# Altium project HYDRA_V3_CAMERA.PrjPcb
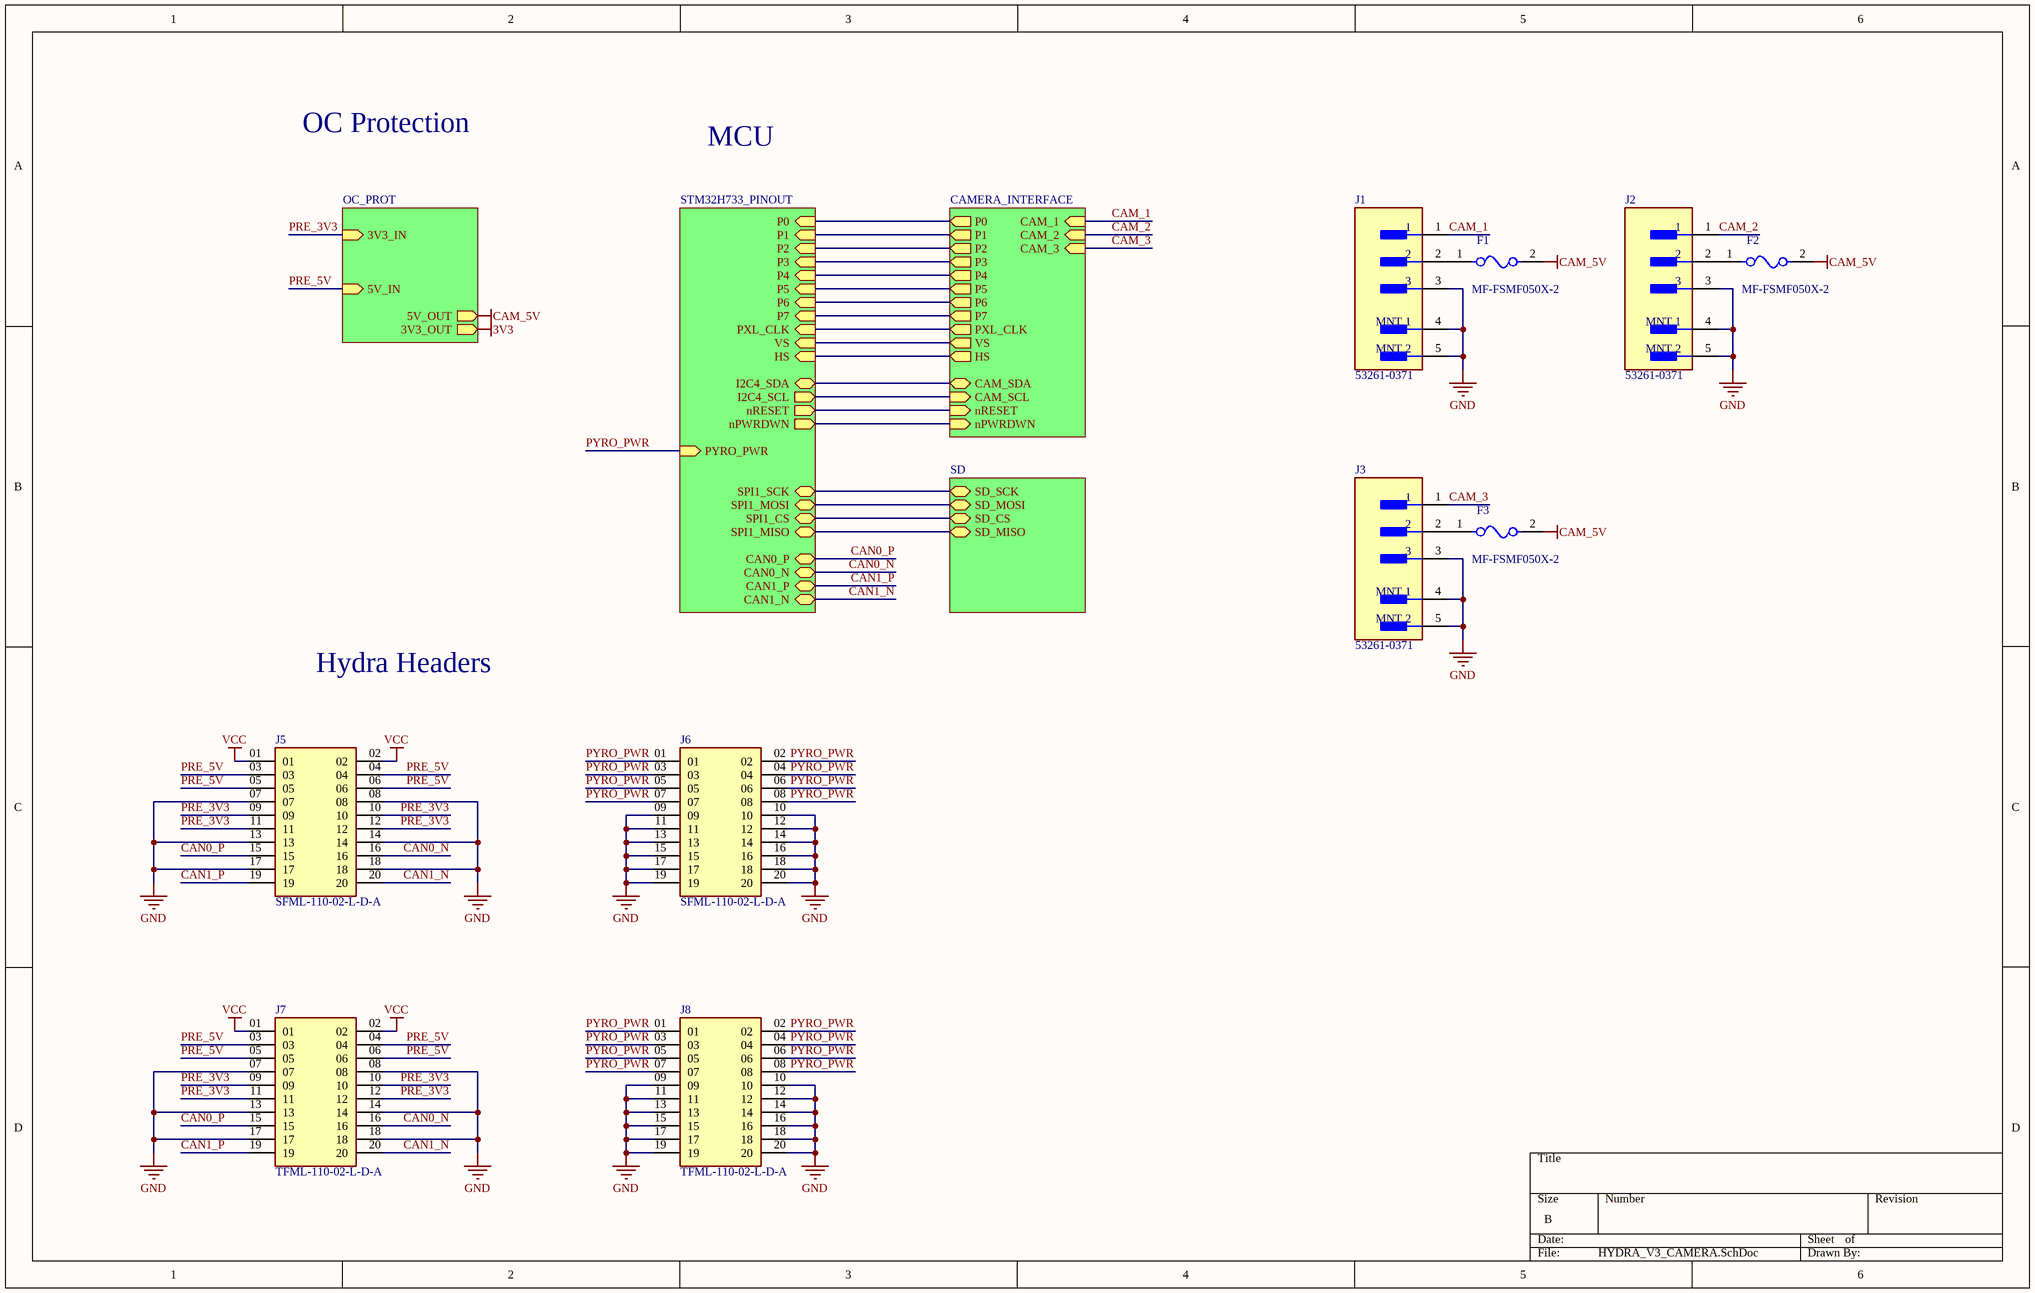
[diagram p0: HYDRA_V3_CAMERA.SchDoc]
5 sheets, 137 parts. Net scope: hierarchical (ports join the sheet entries above them; power ports are global).
Board file: HYDRA_V3_CAMERA.PcbDoc
Sheets:
  HYDRA_V3_CAMERA.SchDoc
    OC_PROT = OC_PROT.SchDoc
    MCU_PINOUT = STM32H733_PINOUT.SchDoc
    SD = SD.SchDoc
    CAMERA_INTERFACE = CAMERA_INTERFACE.SchDoc

## Sheet HYDRA_V3_CAMERA.SchDoc
size B; SheetNumber: 1; SheetTotal: 5

### Parts
F1  MF-FSMF050X-2  [FP-MF-FSMF-MFG]
F2  MF-FSMF050X-2  [FP-MF-FSMF-MFG]
F3  MF-FSMF050X-2  [FP-MF-FSMF-MFG]
J1  53261-0371  [FP-53261-0371-MFG]
J2  53261-0371  [FP-53261-0371-MFG]
J3  53261-0371  [FP-53261-0371-MFG]
J5  SFML-110-02-L-D-A  [SFML-110-02-L-D-A-Footprint-1]
J6  SFML-110-02-L-D-A  [SFML-110-02-L-D-A-Footprint-1]
J7  TFML-110-02-L-D-A  [TFML-110-02-L-D-A-Footprint-1]
J8  TFML-110-02-L-D-A  [TFML-110-02-L-D-A-Footprint-1]

### Sub-sheets
CAMERA_INTERFACE = CAMERA_INTERFACE: P0 (out), P1 (out), P2 (out), P3 (out), P4 (out), P5 (out), P6 (out), P7 (out), PXL_CLK (out), VS (out), HS (out), CAM_1 (in), CAM_2 (in), CAM_3 (in), CAM_SDA (bidir), CAM_SCL (in), nRESET (in), nPWRDWN (in)
MCU_PINOUT = STM32H733_PINOUT: CAN0_P (bidir), CAN0_N (bidir), PYRO_PWR (in), CAN1_P (bidir), CAN1_N (bidir), SPI1_SCK (bidir), SPI1_MISO (bidir), SPI1_MOSI (bidir), SPI1_CS (bidir), P0 (in), P1 (in), P2 (in), P3 (in), P4 (in), P5 (in), P6 (in), P7 (in), PXL_CLK (in), VS (in), HS (in), I2C4_SDA (bidir), I2C4_SCL (out), nRESET (out), nPWRDWN (out)
OC_PROT = OC_PROT: 5V_OUT (out), 5V_IN (in), 3V3_IN (in), 3V3_OUT (out)
SD = SD: SD_SCK (bidir), SD_MOSI (bidir), SD_CS (bidir), SD_MISO (bidir)

### Nets
CAM_5V: F1.2 F2.2 F3.2 ; sheet OC_PROT/5V_OUT
GND: J1.3 J1.4(MNT_1) J1.5(MNT_2) J2.3 J2.4(MNT_1) J2.5(MNT_2) J3.3 J3.4(MNT_1) J3.5(MNT_2) J5.07 J5.08 J5.13 J5.14 J5.17 J5.18 J6.09 J6.10 J6.11 J6.12 J6.13 J6.14 J6.15 J6.16 J6.17 J6.18 J6.19 J6.20 J7.07 J7.08 J7.13 J7.14 J7.17 J7.18 J8.09 J8.10 J8.11 J8.12 J8.13 J8.14 J8.15 J8.16 J8.17 J8.18 J8.19 J8.20
VCC: J5.01 J5.02 J7.01 J7.02
CAM_1: J1.1 ; sheet CAMERA_INTERFACE/CAM_1
CAM_2: J2.1 ; sheet CAMERA_INTERFACE/CAM_2
CAM_3: J3.1 ; sheet CAMERA_INTERFACE/CAM_3
CAM_SCL: sheet MCU_PINOUT/I2C4_SCL, sheet CAMERA_INTERFACE/CAM_SCL
CAM_SDA: sheet MCU_PINOUT/I2C4_SDA, sheet CAMERA_INTERFACE/CAM_SDA
CAN0_N: J5.16 J7.16 ; sheet MCU_PINOUT/CAN0_N
CAN0_P: J5.15 J7.15 ; sheet MCU_PINOUT/CAN0_P
CAN1_N: J5.20 J7.20 ; sheet MCU_PINOUT/CAN1_N
CAN1_P: J5.19 J7.19 ; sheet MCU_PINOUT/CAN1_P
HS: sheet MCU_PINOUT/HS, sheet CAMERA_INTERFACE/HS
LLC: sheet MCU_PINOUT/PXL_CLK, sheet CAMERA_INTERFACE/PXL_CLK
nPWRDWN: sheet MCU_PINOUT/nPWRDWN, sheet CAMERA_INTERFACE/nPWRDWN
nRESET: sheet MCU_PINOUT/nRESET, sheet CAMERA_INTERFACE/nRESET
P0: sheet MCU_PINOUT/P0, sheet CAMERA_INTERFACE/P0
P1: sheet MCU_PINOUT/P1, sheet CAMERA_INTERFACE/P1
P2: sheet MCU_PINOUT/P2, sheet CAMERA_INTERFACE/P2
P3: sheet MCU_PINOUT/P3, sheet CAMERA_INTERFACE/P3
P4: sheet MCU_PINOUT/P4, sheet CAMERA_INTERFACE/P4
P5: sheet MCU_PINOUT/P5, sheet CAMERA_INTERFACE/P5
P6: sheet MCU_PINOUT/P6, sheet CAMERA_INTERFACE/P6
P7: sheet MCU_PINOUT/P7, sheet CAMERA_INTERFACE/P7
PRE_3V3: J5.09 J5.10 J5.11 J5.12 J7.09 J7.10 J7.11 J7.12 ; sheet OC_PROT/3V3_IN  [project net 3V3_PRE_SHUNT]
PRE_5V: J5.03 J5.04 J5.05 J5.06 J7.03 J7.04 J7.05 J7.06 ; sheet OC_PROT/5V_IN  [project net 5V_PRE_SHUNT]
PYRO_PWR: J6.01 J6.02 J6.03 J6.04 J6.05 J6.06 J6.07 J6.08 J8.01 J8.02 J8.03 J8.04 J8.05 J8.06 J8.07 J8.08 ; sheet MCU_PINOUT/PYRO_PWR
SD_CLK: sheet MCU_PINOUT/SPI1_SCK, sheet SD/SD_SCK
SD_CMD: sheet MCU_PINOUT/SPI1_MOSI, sheet SD/SD_MOSI
SD_CS: sheet MCU_PINOUT/SPI1_CS, sheet SD/SD_CS
SD_DAT0: sheet MCU_PINOUT/SPI1_MISO, sheet SD/SD_MISO
VS: sheet MCU_PINOUT/VS, sheet CAMERA_INTERFACE/VS
NetF1_1: F1.1 J1.2
NetF2_1: F2.1 J2.2
NetF3_1: F3.1 J3.2

### Notes on the sheet
- OC Protection
- MCU
- Hydra Headers

### Library data of the parts
F1-F3 = CMP-07400-000010-1: PTC RESET FUSE 6V 500MA 0603; Manufacturer: Bourns Inc.; Trip Current: 1A; Current Rating: 40A; Hold Current: 0.5A; Resistance: 0.1-0.8Ω; Value: 0.1-0.8Ω; Trip Time: 0.1s; Mouser Description: Resettable Fuses - PPTC 6volts 40amps; Category: Fuse; Digikey Description: PTC RESET FUSE 6V 500MA 0603; Temperature: -40°C to +85°C; Device Class L3: unset; Automotive: No; RoHS: TRUE; Ambient Temperature Range High: +85°C; Device Class L2: PTC Resettable Fuses; Temperature Range High: +85°C; Voltage Rating: 6V; Package: MF-FSMF; Manufacturer Part Number: MF-FSMF050X-2; Ambient Temperature Range Low: -40°C; Lead Free: Yes; ComponentLink2Description: Datasheet; Octopart: https://octopart.com/mf-fsmf050x-2-bourns-10470804; ComponentLink2URL: https://www.bourns.com/docs/Product-Datasheets/mffsmf.pdf; Temperature Range Low: -40°C; Height: 1mm; Device Class L1: Circuit Protection
J1-J3 = CMP-04776-000071-1: CONN HEADER SMD R/A 3POS 1.25MM; Manufacturer: Molex; Number Of Contacts: 3; Conn Orientation: Right Angle; Current Rating: 1A; Voltage Rating: 125V; Conn Gender: Male; Category: Conn; Automotive: No; Footprint Url: https://www.molex.com/pdm_docs/sd/532610371_sd.pdf; Height: 3.6mm; Number Of Rows: 1; Temperature Range Low: -40°C; Package: 0; Octopart: https://octopart.com/53261-0371-molex-655314; ComponentLink2Description: Datasheet; Lead Free: Yes; Ambient Temperature Range Low: -40°C; Device Class L3: unset; Mouser Description: 1.25mm (.049") Pitch PicoBlade Header, Surface Mount, Right Angle, Lead-free, 3 Circuits; Digikey Description: CONN HEADER SMD R/A 3POS 1.25MM; Device Class L2: Headers and Wire Housings; Contact Material: Tin,Nickel; Manufacturer Part Number: 53261-0371; Ambient Temperature Range High: +105°C; ComponentLink2URL: https://www.molex.com/webdocs/datasheets/pdf/en-us/0532610371_PCB_HEADERS.pdf; Pitch: 1.25mm; Temperature: -40°C to +105°C; RoHS: TRUE; Device Class L1: Connectors; Temperature Range High: +105°C
J5 J6 = CMP-002-00076-2: Headers & Wire Housings .050 Tiger Eye High-Reliability Locking Socket Strip
J7 J8 = CMP-002-00077-1: Conn Shrouded Header (4 Sides) HDR 20 POS 1.27mm Solder ST Top Entry SMD TIGER EYE™ Tube

## Sheet OC_PROT.SchDoc
size C; SheetNumber: 2; SheetTotal: 5
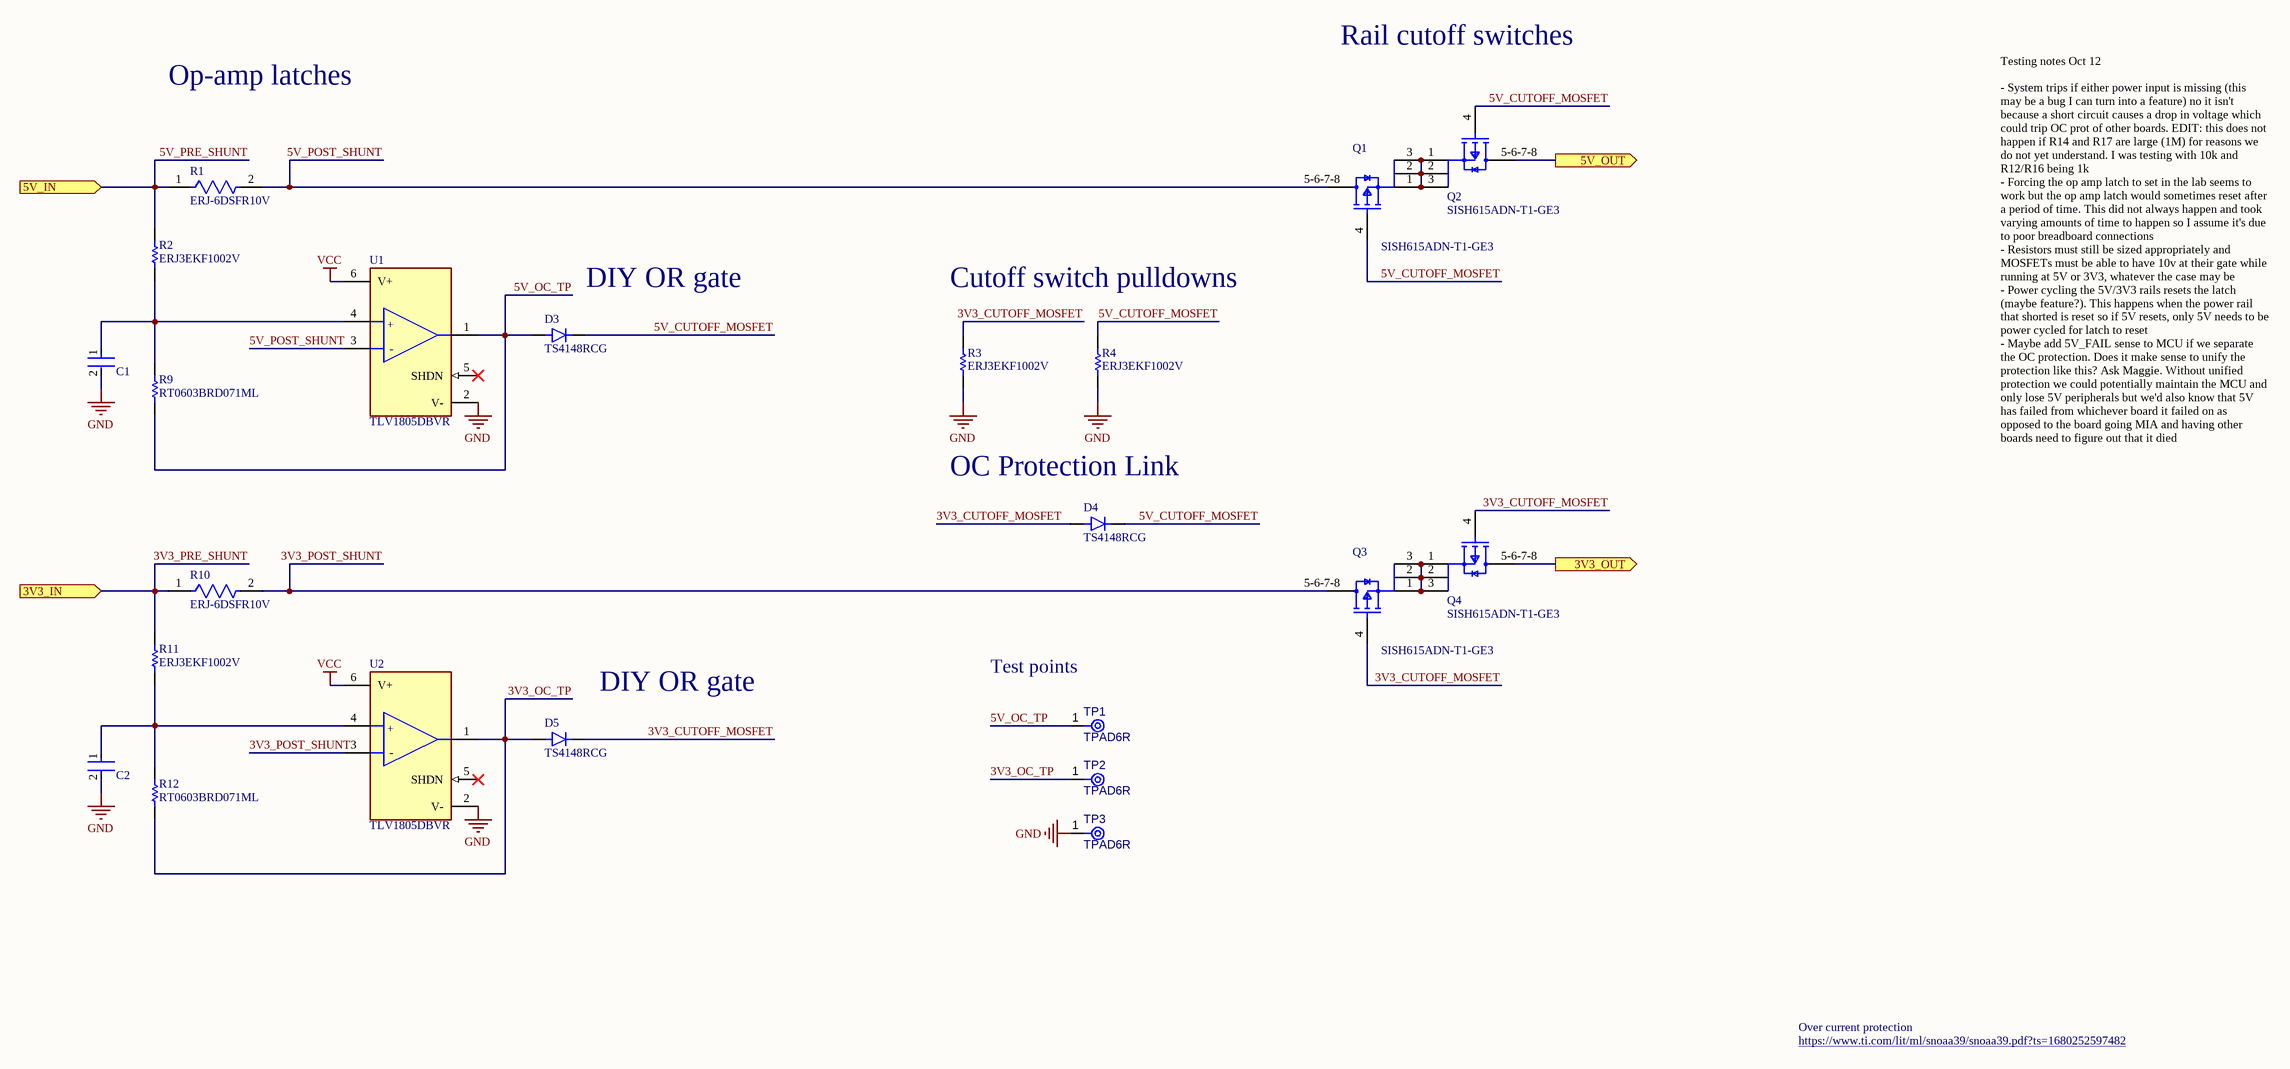
[diagram p1: OC_PROT.SchDoc]

### Parts
C1  C0402C104K8PACTU  [FP-C0402-BB-MFG]  (value not drawn)
C2  C0402C104K8PACTU  [FP-C0402-BB-MFG]  (value not drawn)
D3  TS4148RCG  [TS4148RCG-Footprint-1]
D4  TS4148RCG  [TS4148RCG-Footprint-1]
D5  TS4148RCG  [TS4148RCG-Footprint-1]
Q1  SISH615ADN-T1-GE3  [SISH615ADN-T1-GE3-Footprint-1]
Q2  SISH615ADN-T1-GE3  [SISH615ADN-T1-GE3-Footprint-1]
Q3  SISH615ADN-T1-GE3  [SISH615ADN-T1-GE3-Footprint-1]
Q4  SISH615ADN-T1-GE3  [SISH615ADN-T1-GE3-Footprint-1]
R1  ERJ-6DSFR10V  [FP-ERJ6D-MFG]
R2  ERJ3EKF1002V  [RESC1609X55X30LL15T15]
R3  ERJ3EKF1002V  [RESC1609X55X30LL15T15]
R4  ERJ3EKF1002V  [RESC1609X55X30LL15T15]
R9  RT0603BRD071ML  [RESC1608X55X30NL20T20]
R10  ERJ-6DSFR10V  [FP-ERJ6D-MFG]
R11  ERJ3EKF1002V  [RESC1609X55X30LL15T15]
R12  RT0603BRD071ML  [RESC1608X55X30NL20T20]
TP1  TPAD6R  [TP06R]  (no BOM)
TP2  TPAD6R  [TP06R]  (no BOM)
TP3  TPAD6R  [TP06R]  (no BOM)
U1  TLV1805DBVR  [FP-DBV0006A-IPC_C]
U2  TLV1805DBVR  [FP-DBV0006A-IPC_C]

### Ports
3V3_IN (in, see HYDRA_V3_CAMERA[1A]), 3V3_OUT (out, see HYDRA_V3_CAMERA[2B]), 5V_IN (in, see HYDRA_V3_CAMERA[1A]), 5V_OUT (out, see HYDRA_V3_CAMERA[2A])

### Nets
CAM_5V: Q2.5-6-7-8(D) ; port 5V_OUT
DVDDIO: Q4.5-6-7-8(D) ; port 3V3_OUT
GND: C1.2 C2.2 R3.1 R4.1 TP3.1(TP) U1.2(V-) U2.2(V-)
VCC: U1.6(V+) U2.6(V+)
3V3_CUTOFF_MOSFET: D4.A D5.C(K) Q3.4(G) Q4.4(G) R3.2
3V3_OC_TP: D5.A R12.1 TP2.1(TP) U2.1(OUT)
3V3_POST_SHUNT: Q3.5-6-7-8(D) R10.2 U2.3(-IN)
3V3_PRE_SHUNT: R10.1 R11.2 ; port 3V3_IN
5V_CUTOFF_MOSFET: D3.C(K) D4.C(K) Q1.4(G) Q2.4(G) R4.2
5V_OC_TP: D3.A R9.1 TP1.1(TP) U1.1(OUT)
5V_POST_SHUNT: Q1.5-6-7-8(D) R1.2 U1.3(-IN)
5V_PRE_SHUNT: R1.1 R2.2 ; port 5V_IN
NetC1_1: C1.1 R2.1 R9.2 U1.4(+IN)
NetC2_1: C2.1 R11.1 R12.2 U2.4(+IN)
NetQ1_1: Q1.1(S) Q1.2(S) Q1.3(S) Q2.1(S) Q2.2(S) Q2.3(S)
NetQ3_1: Q3.1(S) Q3.2(S) Q3.3(S) Q4.1(S) Q4.2(S) Q4.3(S)

Not connected (* = marked no-connect by the designer): U1 5(SHDN)*; U2 5(SHDN)*

### Notes on the sheet
- Rail cutoff switches
- Op-amp latches
- (near D3) DIY OR gate
- Cutoff switch pulldowns
- (near D4) OC Protection Link
- Testing notes Oct 12
  - System trips if either power input is missing (this may be a bug I can turn into a feature) no it isn't because a short circuit causes a drop in voltage which could trip OC prot of other boards. EDIT: this does not happen if R14 and R17 are large (1M) for reasons we do not yet understand. I was testing with 10k and R12/R16 being 1k
  - Forcing the op amp latch to set in the lab seems to work but the op amp latch would sometimes reset after a period of time. This did not always happen and took varying amounts of time to happen so I assume it's due to poor breadboard connections
  - Resistors must still be sized appropriately and MOSFETs must be able to have 10v at their gate while running at 5V or 3V3, whatever the case may be
  - Power cycling the 5V/3V3 rails resets the latch (maybe feature?). This happens when the power rail that shorted is reset so if 5V resets, only 5V needs to be power cycled for latch to reset
  - Maybe add 5V_FAIL sense to MCU if we separate the OC protection. Does it make sense to unify the protection like this? Ask Maggie. Without unified protection we could potentially maintain the MCU and only lose 5V peripherals but we'd also know that 5V has failed from whichever board it failed on as opposed to the board going MIA and having other boards need to figure out that it died
- (near TP1) Test points
- (near D5) DIY OR gate
- https://www.ti.com/lit/ml/snoaa39/snoaa39.pdf?ts=1680252597482
- Over current protection
- (in symbol CMP-04896-000098-1) +; -

### Library data of the parts
C1 C2 = CMP-2008-02046-2: CAP CER 0.1UF 10V X5R 0402; Manufacturer: Kemet; Material: Ceramic; Capacitance: 0.10 μF; Temperature Coefficient: 15%; Tolerance: 0.1; Value: 0.10 μF; Package: C0402-BB; Temperature: -55°C to +125°C; ComponentLink2Description: Datasheet; Temperature Characteristic: X5R; Device Class L1: Passive Components; Height: 0.55mm; Lead Free: Yes; ComponentLink2URL: https://content.kemet.com/datasheets/KEM_C1002_X7R_SMD.pdf; Device Class L2: Capacitors; Temperature Range Low: -55°C; Temperature Range High: +125°C; RoHS: TRUE; Octopart: https://octopart.com/c0402c104k8pactu-kemet-140039; Automotive: No; Mouser Description: Capacitor 100 nF 10 VDC 0402; Category: Cap; Voltage Rating: 10 V; Digikey Description: CAP CER 0.1UF 10V X5R 0402; Ipc Land Pattern Name: CAPC10050X50; Device Class L3: Ceramic Capacitors; Manufacturer Part Number: C0402C104K8PACTU
D3-D5 = CMP-004-00036-1: SMD Si-Diode 75V 100mA 0603
Q1-Q4 = CMP-013-00036-1: Trans MOSFET P-CH 20V 22.1A 8-Pin PowerPAK 1212 EP T/R
R1 R10 = CMP-05422-000098-1: RES 0.1 OHM 1% 1/2W 0805; Temperature Coefficient: 150ppm/°C; Resistance: 100mR; Max Power Dissipation: 500mW; Tolerance: 1%; Length: 0.079inch; Features: Automotive AEC-Q200; Width: 0.049inch; Resistor Type: Thick Film; Case Code (Metric): 2012; Number of Terminations: 2; Max Operating Temperature: 155°C; Case/Package: 0805; Height: 0.028inch; Packaging: Cut Tape; Case Code (Imperial): 0805; Min Operating Temperature: -55°C
R2-R4 R11 = CMP-1012-00623-3: Chip Resistor, 10 KOhm, +/- 1%, 0.1 W, -55 to 155 degC, 0603 (1608 Metric), RoHS, Tape and Reel; Manufacturer: Panasonic; Voltage Rating: 75V; Case\/Package: 0603; Power Rating: 100mW; Resistance: 10KOhm; Temperature Coefficient: 100ppm\/degreesC; Number of Pins: 2; Package Reference: 603; Depth: 0.8mm; Mount: SurfaceMount; Package Description: 2-Pin Surface Mount Device, Body 1.6 x 0.85 mm; Datasheet Version: 02/2017; Length: 1.6mm; Lead Free: LeadFree; Height: 0.45mm; Number of Terminations: 2; Max Power Dissipation: 100mW; Min Operating Temperature: -55degC; Datasheet URL: https://industrial.panasonic.com/cdbs/www-data/pdf/RDA0000/AOA0000C304.pdf; Termination: SMD/SMT; Case Code (Metric): 1608; Case Code (Imperial): 0603; Tolerance: 1%; Max Operating Temperature: 155degC; RoHSCompliant: true; Voltage Rating (DC): 75V; Radiation Hardening: No; Packaging: TapeandReel; Composition: ThickFilm; Mounting Technology: SurfaceMount; Manufacturer URL: http://www.panasonic.com/; Width: 0.031inch; REACH SVHC: NoSVHC; Contact Plating: Tin; Military Standard: Not; Package Quantity: 1
R9 R12 = CMP-2000-00925-1: NOT PANASONIC, THIS IS A 1M RESISTORhttps://www.yageo.com/upload/media/product/productsearch/datasheet/rchip/PYu-RT_1-to-0.01_RoHS_L_13.pdf; Part Number: ERA-3AEB163V; Manufacturer: Panasonic
TP1-TP3 = CMP-00028-00002-2: 0.6mm round; Pins: 1
U1 U2 = CMP-04896-000098-1: 40V, RAIL-TO-RAIL INPUT, PUSH-PU

## Sheet STM32H733_PINOUT.SchDoc
size C; SheetNumber: 4; SheetTotal: 5
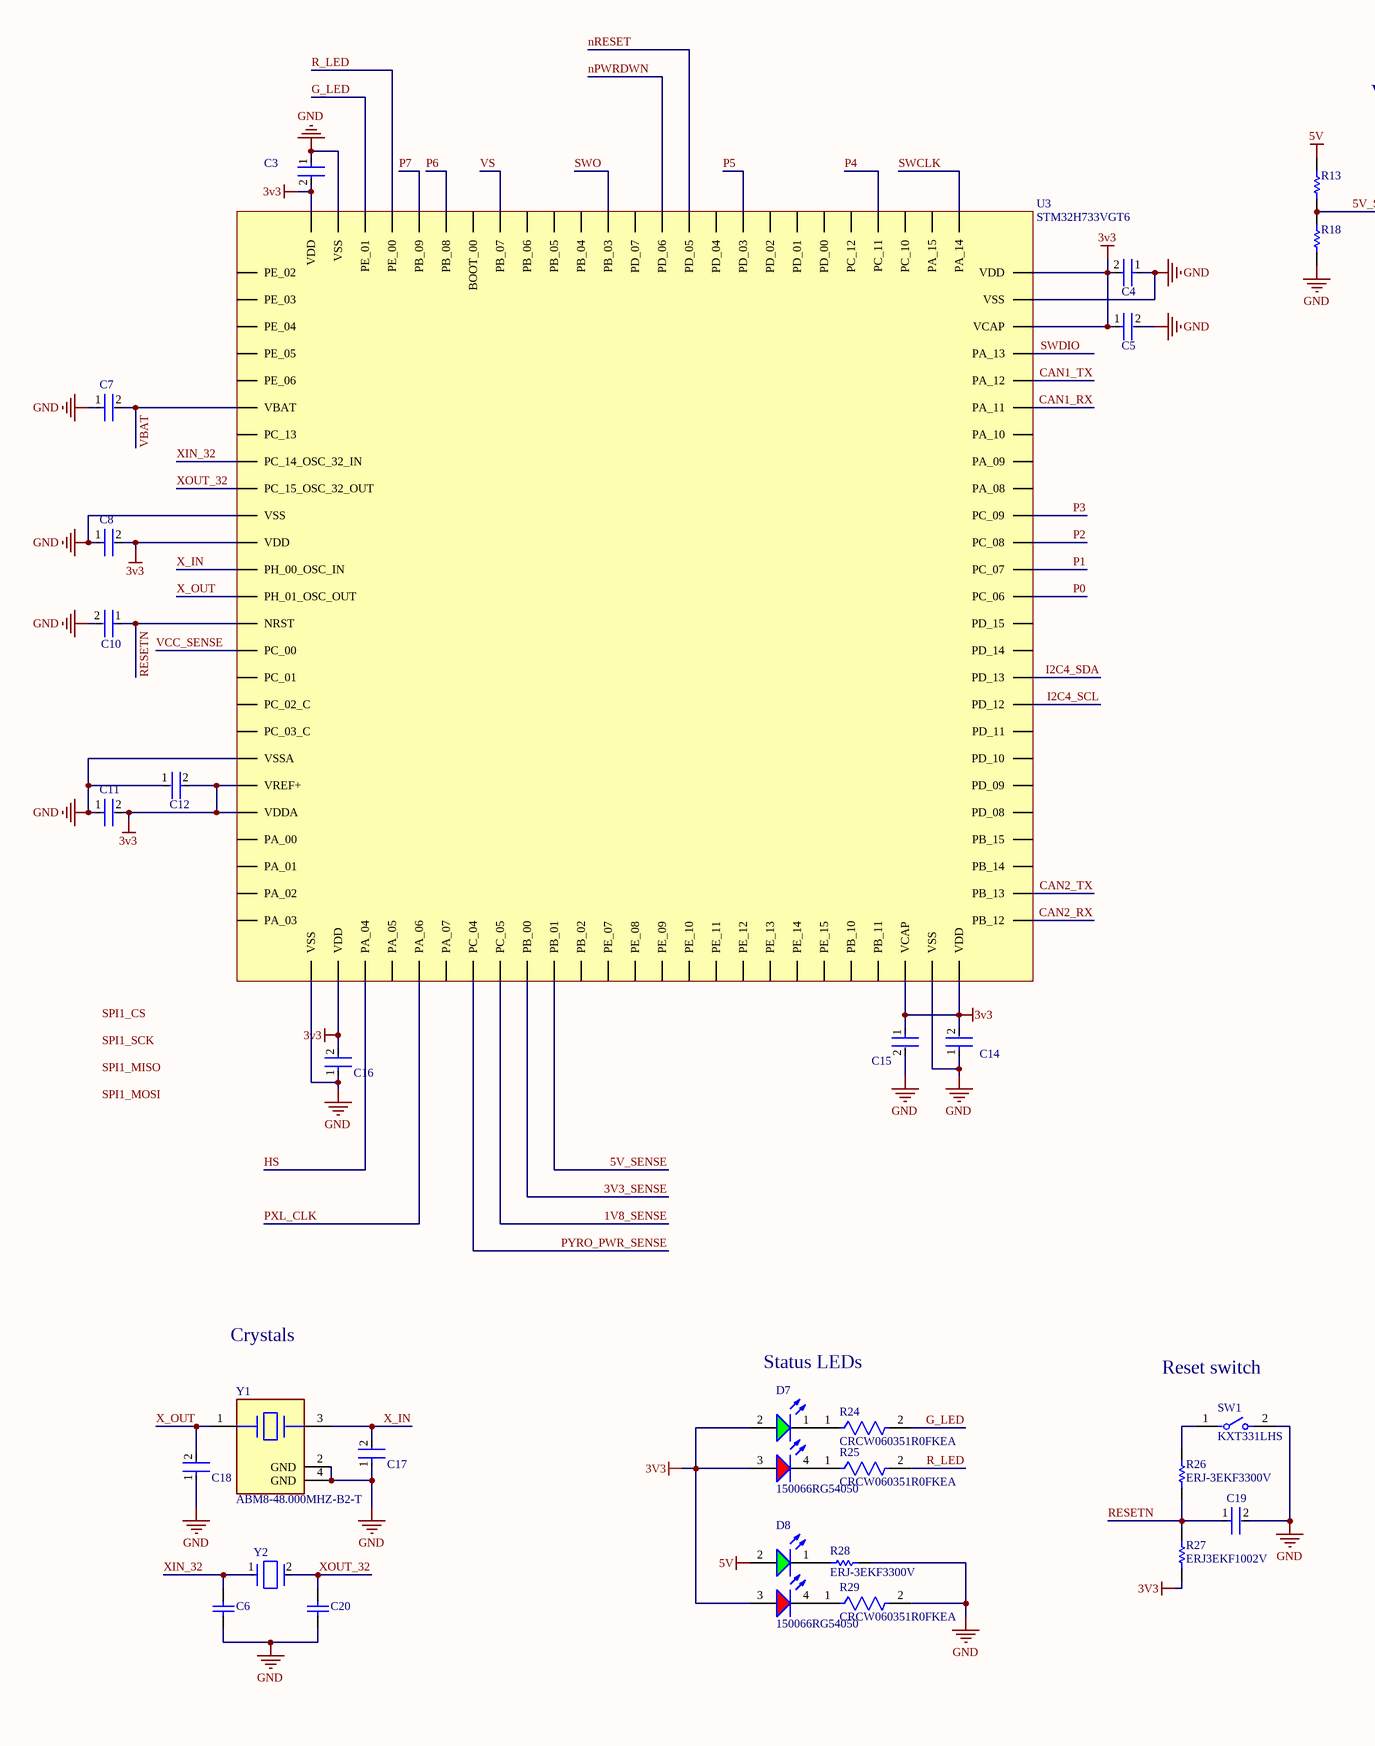
[diagram p2: STM32H733_PINOUT.SchDoc, left]
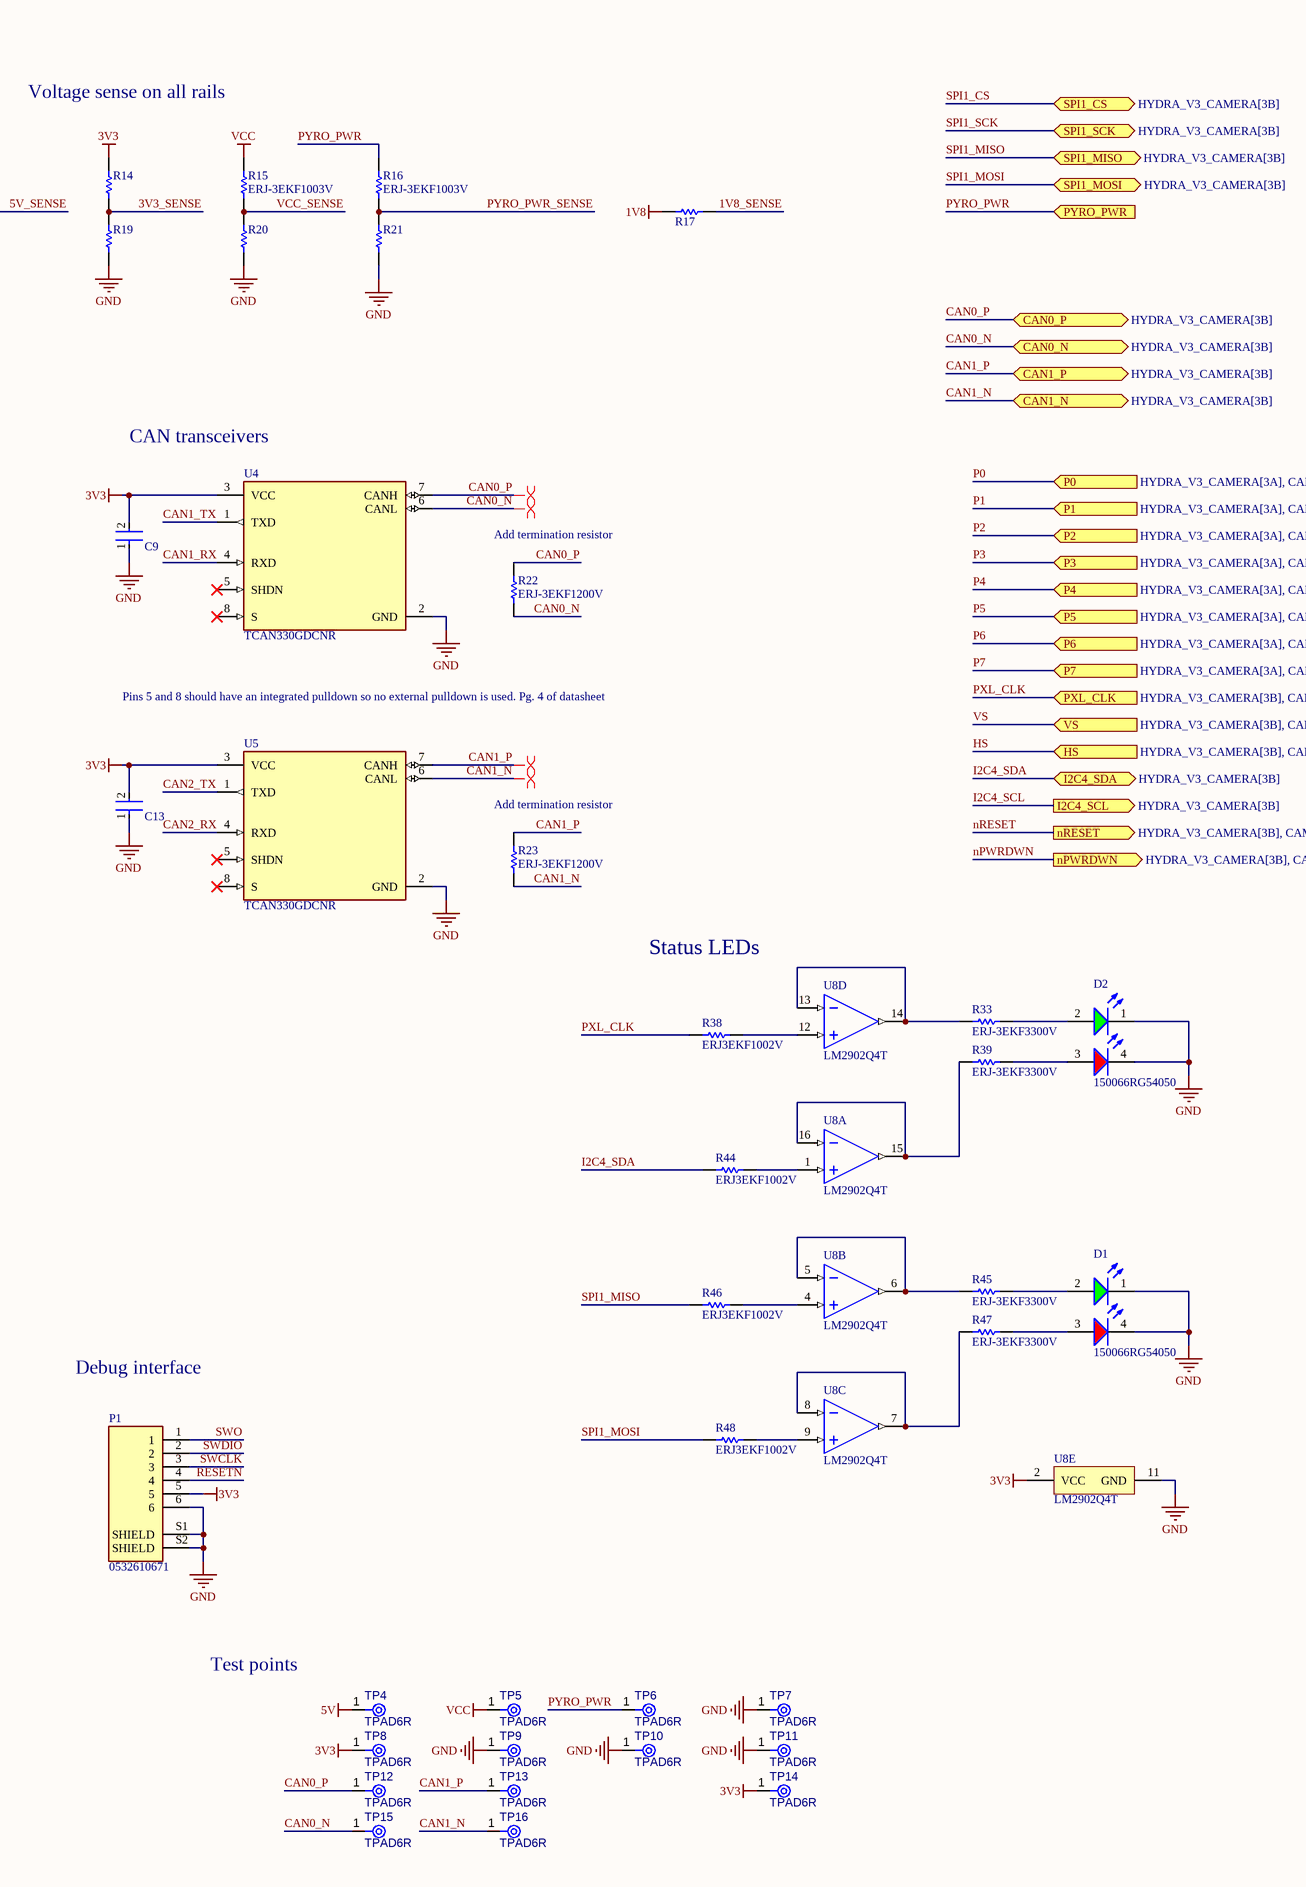
[diagram p3: STM32H733_PINOUT.SchDoc, right]

### Parts
C3  CC0402JRNPO9BN500  [FP-C0402-BB-MFG]  (value not drawn)
C4  CC0402JRNPO9BN500  [FP-C0402-BB-MFG]  (value not drawn)
C5  C1005X7S1A225K050BC  [FP-C1005-050-0_15-0_1-MFG]  (value not drawn)
C6  CC0603JRNPO9BN180  [CAPC1608X90X40LL10T20]  (value not drawn)
C7  CC0402JRNPO9BN500  [FP-C0402-BB-MFG]  (value not drawn)
C8  CC0402JRNPO9BN500  [FP-C0402-BB-MFG]  (value not drawn)
C9  C0402C104K8PACTU  [FP-C0402-BB-MFG]  (value not drawn)
C10  C0402C104K8PACTU  [FP-C0402-BB-MFG]  (value not drawn)
C11  CC0402JRNPO9BN500  [FP-C0402-BB-MFG]  (value not drawn)
C12  GRM155R71C104KA88D  [FP-GRM15-MFG]  (value not drawn)
C13  C0402C104K8PACTU  [FP-C0402-BB-MFG]  (value not drawn)
C14  CC0402JRNPO9BN500  [FP-C0402-BB-MFG]  (value not drawn)
C15  C1005X7S1A225K050BC  [FP-C1005-050-0_15-0_1-MFG]  (value not drawn)
C16  CC0402JRNPO9BN500  [FP-C0402-BB-MFG]  (value not drawn)
C17  08051A6R8CAT2A  [FP-0805-L_2_01_0_2-W_1_25-MFG]  (value not drawn)
C18  08051A6R8CAT2A  [FP-0805-L_2_01_0_2-W_1_25-MFG]  (value not drawn)
C19  C0402C104K8PACTU  [FP-C0402-BB-MFG]  (value not drawn)
C20  CC0603JRNPO9BN180  [CAPC1608X90X40LL10T20]  (value not drawn)
D1  150066RG54050  [WL-SBCD_0606]
D2  150066RG54050  [WL-SBCD_0606]
D7  150066RG54050  [WL-SBCD_0606]
D8  150066RG54050  [WL-SBCD_0606]
P1  0532610671  [0532610671-Footprint-1]
R13  ERJ3EKF1002V  [RESC1609X55X30LL15T15]  (value not drawn)
R14  ERJ3EKF1002V  [RESC1609X55X30LL15T15]  (value not drawn)
R15  ERJ-3EKF1003V  [RESC1608X55X30ML15T15]
R16  ERJ-3EKF1003V  [RESC1608X55X30ML15T15]
R17  ERJ3EKF1002V  [RESC1609X55X30LL15T15]  (value not drawn)
R18  ERJ3EKF1002V  [RESC1609X55X30LL15T15]  (value not drawn)
R19  ERJ3EKF1002V  [RESC1609X55X30LL15T15]  (value not drawn)
R20  ERJ3EKF1002V  [RESC1609X55X30LL15T15]  (value not drawn)
R21  ERJ3EKF1002V  [RESC1609X55X30LL15T15]  (value not drawn)
R22  ERJ-3EKF1200V  [RESC1609X55X30ML15T15]
R23  ERJ-3EKF1200V  [RESC1609X55X30ML15T15]
R24  CRCW060351R0FKEA  [FP-CRCW0603-e3-MFG]
R25  CRCW060351R0FKEA  [FP-CRCW0603-e3-MFG]
R26  ERJ-3EKF3300V  [RESC1608X55X30LL15T15]
R27  ERJ3EKF1002V  [RESC1609X55X30LL15T15]
R28  ERJ-3EKF3300V  [RESC1608X55X30LL15T15]
R29  CRCW060351R0FKEA  [FP-CRCW0603-e3-MFG]
R33  ERJ-3EKF3300V  [RESC1608X55X30LL15T15]
R38  ERJ3EKF1002V  [RESC1609X55X30LL15T15]
R39  ERJ-3EKF3300V  [RESC1608X55X30LL15T15]
R44  ERJ3EKF1002V  [RESC1609X55X30LL15T15]
R45  ERJ-3EKF3300V  [RESC1608X55X30LL15T15]
R46  ERJ3EKF1002V  [RESC1609X55X30LL15T15]
R47  ERJ-3EKF3300V  [RESC1608X55X30LL15T15]
R48  ERJ3EKF1002V  [RESC1609X55X30LL15T15]
SW1  KXT331LHS  [FP-KXT331LHS-MFG]
TP4  TPAD6R  [TP06R]  (no BOM)
TP5  TPAD6R  [TP06R]  (no BOM)
TP6  TPAD6R  [TP06R]  (no BOM)
TP7  TPAD6R  [TP06R]  (no BOM)
TP8  TPAD6R  [TP06R]  (no BOM)
TP9  TPAD6R  [TP06R]  (no BOM)
TP10  TPAD6R  [TP06R]  (no BOM)
TP11  TPAD6R  [TP06R]  (no BOM)
TP12  TPAD6R  [TP06R]  (no BOM)
TP13  TPAD6R  [TP06R]  (no BOM)
TP14  TPAD6R  [TP06R]  (no BOM)
TP15  TPAD6R  [TP06R]  (no BOM)
TP16  TPAD6R  [TP06R]  (no BOM)
U3  STM32H733VGT6  [STM32H733VGT6-Footprint-1]
U4  TCAN330GDCNR  [FP-DCN0008A-MFG]
U5  TCAN330GDCNR  [FP-DCN0008A-MFG]
U8  LM2902Q4T  [LM2902Q4T-Footprint-1]  (parts A,B,C,D,E of 5)
Y1  ABM8-48.000MHZ-B2-T  [FP-ABM8-MFG]
Y2  ECS-.327-12.5-1210-TR  [FP-ECX-1210-MFG]  (value not drawn)

### Ports
CAN0_N (bidir, see HYDRA_V3_CAMERA[3B]), CAN0_P (bidir, see HYDRA_V3_CAMERA[3B]), CAN1_N (bidir, see HYDRA_V3_CAMERA[3B]), CAN1_P (bidir, see HYDRA_V3_CAMERA[3B]), HS (in, see HYDRA_V3_CAMERA[3B], CAMERA_INTERFACE[6B]), I2C4_SCL (out, see HYDRA_V3_CAMERA[3B]), I2C4_SDA (bidir, see HYDRA_V3_CAMERA[3B]), nPWRDWN (out, see HYDRA_V3_CAMERA[3B], CAMERA_INTERFACE[6A]), nRESET (out, see HYDRA_V3_CAMERA[3B], CAMERA_INTERFACE[6A]), P0 (in, see HYDRA_V3_CAMERA[3A], CAMERA_INTERFACE[6B]), P1 (in, see HYDRA_V3_CAMERA[3A], CAMERA_INTERFACE[6B]), P2 (in, see HYDRA_V3_CAMERA[3A], CAMERA_INTERFACE[6B]), P3 (in, see HYDRA_V3_CAMERA[3A], CAMERA_INTERFACE[6B]), P4 (in, see HYDRA_V3_CAMERA[3A], CAMERA_INTERFACE[6B]), P5 (in, see HYDRA_V3_CAMERA[3A], CAMERA_INTERFACE[6B]), P6 (in, see HYDRA_V3_CAMERA[3A], CAMERA_INTERFACE[6B]), P7 (in, see HYDRA_V3_CAMERA[3A], CAMERA_INTERFACE[6B]), PXL_CLK (in, see HYDRA_V3_CAMERA[3B], CAMERA_INTERFACE[6B]), PYRO_PWR (in, see HYDRA_V3_CAMERA[3B]), SPI1_CS (bidir, see HYDRA_V3_CAMERA[3B]), SPI1_MISO (bidir, see HYDRA_V3_CAMERA[3B]), SPI1_MOSI (bidir, see HYDRA_V3_CAMERA[3B]), SPI1_SCK (bidir, see HYDRA_V3_CAMERA[3B]), VS (in, see HYDRA_V3_CAMERA[3B], CAMERA_INTERFACE[6B])

### Nets
1V8: R17.2  [project net AVDD]
3v3: C3.2 C4.2 C5.1 C8.2 C9.2 C11.2 C12.2 C13.2 C14.2 C15.1 C16.2 D7.2(A) D7.3(A) D8.3(A) P1.5 R14.2 R27.1 TP8.1(TP) TP14.1(TP) U3.11(VDD) U3.20(VREF+) U3.21(VDDA) U3.27(VDD) U3.48(VCAP) U3.50(VDD) U3.73(VCAP) U3.75(VDD) U3.100(VDD) U4.3(VCC) U5.3(VCC) U8.2(VCC)  [project net DVDDIO]
5V: D8.2(A) R13.2 TP4.1(TP)
GND: C3.1 C4.1 C5.2 C6.1 C7.1 C8.1 C9.1 C10.2 C11.1 C12.1 C13.1 C14.1 C15.2 C16.1 C17.1 C18.1 C19.2 C20.1 D1.1(K) D1.4(K) D2.1(K) D2.4(K) P1.6 P1.S1(SHIELD) P1.S2(SHIELD) R18.1 R19.1 R20.1 R21.1 R28.2 R29.2 SW1.2 TP7.1(TP) TP9.1(TP) TP10.1(TP) TP11.1(TP) U3.10(VSS) U3.19(VSSA) U3.26(VSS) U3.49(VSS) U3.74(VSS) U3.99(VSS) U4.2(GND) U5.2(GND) U8.11(GND) Y1.2(GND) Y1.4(GND)
VCC: R15.2 TP5.1(TP)
1V8_SENSE: R17.1 U3.33(PC_05)
3V3_SENSE: R14.1 R19.2 U3.34(PB_00)
5V_SENSE: R13.1 R18.2 U3.35(PB_01)
CAN0_N: R22.1 TP15.1(TP) U4.6(CANL) ; port CAN0_N
CAN0_P: R22.2 TP12.1(TP) U4.7(CANH) ; port CAN0_P
CAN1_N: R23.1 TP16.1(TP) U5.6(CANL) ; port CAN1_N
CAN1_P: R23.2 TP13.1(TP) U5.7(CANH) ; port CAN1_P
CAN1_RX: U3.70(PA_11) U4.4(RXD)
CAN1_TX: U3.71(PA_12) U4.1(TXD)
CAN2_RX: U3.51(PB_12) U5.4(RXD)
CAN2_TX: U3.52(PB_13) U5.1(TXD)
G_LED: R24.2 U3.98(PE_01)
HS: U3.28(PA_04) ; port HS
I2C4_SCL: U3.59(PD_12) ; port I2C4_SCL  [project net CAM_SCL]
I2C4_SDA: R44.2 U3.60(PD_13) ; port I2C4_SDA  [project net CAM_SDA]
nPWRDWN: U3.87(PD_06) ; port nPWRDWN
nRESET: U3.86(PD_05) ; port nRESET
P0: U3.63(PC_06) ; port P0
P1: U3.64(PC_07) ; port P1
P2: U3.65(PC_08) ; port P2
P3: U3.66(PC_09) ; port P3
P4: U3.79(PC_11) ; port P4
P5: U3.84(PD_03) ; port P5
P6: U3.95(PB_08) ; port P6
P7: U3.96(PB_09) ; port P7
PXL_CLK: R38.1 U3.30(PA_06) ; port PXL_CLK  [project net LLC]
PYRO_PWR: R16.2 TP6.1(TP) ; port PYRO_PWR
PYRO_PWR_SENSE: R16.1 R21.2 U3.32(PC_04)
R_LED: R25.2 U3.97(PE_00)
RESETN: C10.1 C19.1 P1.4 R26.1 R27.2 U3.14(NRST)
SPI1_MISO: R46.1 ; port SPI1_MISO  [project net SD_DAT0]
SPI1_MOSI: R48.2 ; port SPI1_MOSI  [project net SD_CMD]
SWCLK: P1.3 U3.76(PA_14)
SWDIO: P1.2 U3.72(PA_13)
SWO: P1.1 U3.89(PB_03)
VBAT: C7.2 U3.6(VBAT)
VCC_SENSE: R15.1 R20.2 U3.15(PC_00)
VS: U3.93(PB_07) ; port VS
X_IN: C17.2 U3.12(PH_00_OSC_IN) Y1.3
X_OUT: C18.2 U3.13(PH_01_OSC_OUT) Y1.1
XIN_32: C6.2 U3.8(PC_14_OSC_32_IN) Y2.1(In/Out)
XOUT_32: C20.2 U3.9(PC_15_OSC_32_OUT) Y2.2(Out/In)
NetD1_2: D1.2(A) R45.2
NetD1_3: D1.3(A) R47.2
NetD2_2: D2.2(A) R33.2
NetD2_3: D2.3(A) R39.2
NetD7_1: D7.1(K) R24.1
NetD7_4: D7.4(K) R25.1
NetD8_1: D8.1(K) R28.1
NetD8_4: D8.4(K) R29.1
NetR26_2: R26.2 SW1.1
NetR33_1: R33.1 U8.13(4IN-) U8.14(4OUT)
NetR38_2: R38.2 U8.12(4IN+)
NetR39_1: R39.1 U8.15(1OUT) U8.16(1IN-)
NetR44_1: R44.1 U8.1(1IN+)
NetR45_1: R45.1 U8.5(2IN-) U8.6(2OUT)
NetR46_2: R46.2 U8.4(2IN+)
NetR47_1: R47.1 U8.7(3OUT) U8.8(3IN-)
NetR48_1: R48.1 U8.9(3IN+)

Not connected (* = marked no-connect by the designer): U3 1(PE_02) 2(PE_03) 3(PE_04) 4(PE_05) 5(PE_06) 7(PC_13) 16(PC_01) 17(PC_02_C) 18(PC_03_C) 22(PA_00) 23(PA_01) 24(PA_02) 25(PA_03) 29(PA_05) 31(PA_07) 36(PB_02) 37(PE_07) 38(PE_08) 39(PE_09) 40(PE_10) 41(PE_11) 42(PE_12) 43(PE_13) 44(PE_14) 45(PE_15) 46(PB_10) 47(PB_11) 53(PB_14) 54(PB_15) 55(PD_08) 56(PD_09) 57(PD_10) 58(PD_11) 61(PD_14) 62(PD_15) 67(PA_08) 68(PA_09) 69(PA_10) 77(PA_15) 78(PC_10) 80(PC_12) 81(PD_00) 82(PD_01) 83(PD_02) 85(PD_04) 88(PD_07) 90(PB_04) 91(PB_05) 92(PB_06) 94(BOOT_00); U4 5(SHDN)* 8(S)*; U5 5(SHDN)* 8(S)*

### Layout directives
differential pair: CAN0_N, CAN0_P, CAN1_N, CAN1_P

### Notes on the sheet
- Voltage sense on all rails
- (near U4) CAN transceivers
- (near R22) Add termination resistor
- Pins 5 and 8 should have an integrated pulldown so no external pulldown is used. Pg. 4 of datasheet
- (near R23) Add termination resistor
- Status LEDs
- Crystals
- (near SW1) Reset switch
- Debug interface
- Test points
- Labels drawn without touching a wire or pin: SPI1_CS, SPI1_MISO, SPI1_MOSI, SPI1_SCK

### Library data of the parts
C3 C4 C7 C8 C11 C14 C16 = CMP-2008-02046-2: Actually CC0402JRNPO9BN500; Manufacturer: Kemet; Manufacturer Part Number: C0402C104K8PACTU; Material: Ceramic; Capacitance: 50 pF; Temperature Characteristic: X5R; Temperature Coefficient: 15%; Tolerance: 0.1; Voltage Rating: 10 V; Value: 50 pF; Package: C0402-BB; Temperature: -55°C to +125°C; ComponentLink2Description: Datasheet; Device Class L1: Passive Components; Height: 0.55mm; Lead Free: Yes; ComponentLink2URL: https://content.kemet.com/datasheets/KEM_C1002_X7R_SMD.pdf; Device Class L2: Capacitors; Temperature Range Low: -55°C; Temperature Range High: +125°C; RoHS: TRUE; Octopart: https://octopart.com/c0402c104k8pactu-kemet-140039; Automotive: No; Mouser Description: Capacitor 100 nF 10 VDC 0402; Category: Cap; Digikey Description: CAP CER 0.1UF 10V X5R 0402; Ipc Land Pattern Name: CAPC10050X50; Device Class L3: Ceramic Capacitors
C5 C15 = CMP-08246-004344-1: CAP CER 2.2UF 10V X7S 0402; Dielectric Material: Ceramic; Tolerance: 10%; Mount: Surface Mount; Height: 0.5mm; Package Quantity: 1; Depth: 0.5mm; RoHS Compliant: Yes; Length: 1mm; Thickness: 0.022inch; Packaging: Tape and Reel; Capacitance: 2.2uF; Case Code (Imperial): 0402; Resistor Type: Ceramic; Dielectric: X7S; Case/Package: 0402; Min Operating Temperature: -55°C; Voltage Rating: 10V; Series: C; Weight: 2.3E-05oz; Width: 0.02inch; Voltage Rating (DC): 10V; Case Code (Metric): 1005; Max Operating Temperature: 125°C; Termination: SMD/SMT; Lead Free: Lead Free
C6 C20 = CMP-1659-00030-1: Chip Capacitor, 18 pF, +/- 5%, 50 V, -55 to 125 degC, 0603 (1608 Metric), RoHS, Tape and Reel; Voltage Rating: 50 V; Case\Package: 0603; Power Rating: 100 mW; Resistance: 68.1 Ohm; Tolerance: 1%; Case Code (Metric): 1608; Max Operating Temperature: 155 degC; RoHSCompliant: true; Case Code (Imperial): 0603; ComponentLink2Description: Datasheet; Package Quantity: 200; PackageReference: 0603; ComponentLink2URL: http://www.yageo.com/NewPortal/yageodocoutput?fileName=/pdf/MLCC/UPY-GP_NP0_16V-to-50V_14.pdf; Length: 1.6 mm; DatasheetVersion: Rev. 14, 07/2016; Min Operating Temperature: -55 degC; ComponentLink1URL: http://www.yageo.com/; Width: 0.8 mm; ComponentLink1Description: Manufacturer URL; Height: 0.45 mm; Radiation Hardening: No; PackageDescription: 2-Pin Surface Mount Device, Body 1.6 x 0.8 mm; Packaging: Tape and Reel
C9 C10 C13 C19 = CMP-2008-02046-2: as C1 on sheet OC_PROT; Package: C0402-BB; Temperature: -55°C to +125°C; ComponentLink2Description: Datasheet; Temperature Characteristic: X5R; Device Class L1: Passive Components; Height: 0.55mm; Lead Free: Yes; ComponentLink2URL: https://content.kemet.com/datasheets/KEM_C1002_X7R_SMD.pdf; Device Class L2: Capacitors; Temperature Range Low: -55°C; Temperature Range High: +125°C; RoHS: TRUE; Octopart: https://octopart.com/c0402c104k8pactu-kemet-140039; Automotive: No; Mouser Description: Capacitor 100 nF 10 VDC 0402; Category: Cap; Voltage Rating: 10 V; Digikey Description: CAP CER 0.1UF 10V X5R 0402; Ipc Land Pattern Name: CAPC10050X50; Device Class L3: Ceramic Capacitors; Manufacturer Part Number: C0402C104K8PACTU
C12 = CMP-2100-03641-2: CAP CER 0.1UF 16V X7R 0402; Manufacturer: Murata; Standoff Height: 0mm; Tolerance: 10%; Voltage Rating: 16Vdc; Material: Ceramic; Capacitance: 0.10μF; Value: 0.10μF; RoHS: TRUE; Manufacturer Part Number: GRM155R71C104KA88D; Temperature Characteristic: X7R; Octopart: https://octopart.com/grm155r71c104ka88d-murata-196880; Digikey Description: CAP CER 0.1UF 16V X7R 0402; Device Class L3: Ceramic Capacitors; Height: 0.55mm; ComponentLink2Description: Datasheet; Temperature Range Low: -55°C; Ipc Land Pattern Name: CAPC10050X219; ComponentLink2URL: https://search.murata.co.jp/Ceramy/image/img/A01X/G101/ENG/GRM155R71H471KA01-01A.pdf; Device Class L1: Passive Components; Lead Free: yes; Category: Cap; Package: GRM15; Temperature: -55°C to +125°C; Device Class L2: Capacitors; Temperature Range High: +125°C; Mouser Description: 0402 0.1 uF 16V ±10 % Tolerance X7R SMT Multilayer Ceramic Capacitor
C17 C18 = CMP-1036-00709-3: General Purpose Ceramic Capacitor, 0805, 6.8pF, 0.25pF, C0G, 30ppm/°C, 100V; Dissipation Factor: 10%; Insulation Resistance: 100GR; Tolerance: 5%; Max Operating Temperature: 125°C; RoHS Compliant: Yes; Capacitance: 6.8pF; Termination: SMD/SMT; Number of Pins: 2; Packaging: Tape and Reel; Mount: Surface Mount; Case Code (Metric): 2012; Case Code (Imperial): 0805; Height: 0.71mm; Min Operating Temperature: -55°C; Width: 0.049inch; Temperature Coefficient: 0ppm/°C; Length: 2.01mm; Dielectric: C0G; Series: -; Voltage Rating (DC): 100V; Dielectric Material: Ceramic; Depth: 1.25mm; Contact Plating: Tin; Voltage Rating: 100V; Thickness: 0.037inch; Case/Package: 0805; Lead Free: Lead Free; Radiation Hardening: No; Voltage: 100V; Construction: Flat; Package Quantity: 1; REACH SVHC: No SVHC
D1 D2 D7 D8 = CMP-004-00034-2: Led, Red/Grn, 180Mcd/230Mcd, 624Nm/525Nm Rohs Compliant: Yes
P1 = CMP-002-00079-1: Conn Shrouded Header (4 Sides) HDR 6 POS 1.25mm Solder RA Side Entry SMD PicoBlade™ T/R
R13 R14 R17-R21 R27 R38 R44 R46 R48 = CMP-1012-00623-3: as R2 on sheet OC_PROT; Number of Pins: 2; Package Reference: 603; Depth: 0.8mm; Mount: SurfaceMount; Package Description: 2-Pin Surface Mount Device, Body 1.6 x 0.85 mm; Datasheet Version: 02/2017; Length: 1.6mm; Lead Free: LeadFree; Height: 0.45mm; Number of Terminations: 2; Max Power Dissipation: 100mW; Min Operating Temperature: -55degC; Datasheet URL: https://industrial.panasonic.com/cdbs/www-data/pdf/RDA0000/AOA0000C304.pdf; Termination: SMD/SMT; Case Code (Metric): 1608; Case Code (Imperial): 0603; Tolerance: 1%; Max Operating Temperature: 155degC; RoHSCompliant: true; Voltage Rating (DC): 75V; Radiation Hardening: No; Packaging: TapeandReel; Composition: ThickFilm; Mounting Technology: SurfaceMount; Manufacturer URL: http://www.panasonic.com/; Width: 0.031inch; REACH SVHC: NoSVHC; Contact Plating: Tin; Military Standard: Not; Package Quantity: 1
R15 R16 = CMP-2000-00182-1: Manufacturer: Panasonic; Part Number: ERJ-3EKF1003V
R22 R23 = CMP-2000-00213-2: Chip Resistor, 120 Ohm, +/- 1%, 0.1 W, -55 to 155 degC, 0603 (1608 Metric), RoHS, Tape and Reel; Manufacturer: Panasonic; Power Rating: 100mW; Voltage Rating (DC): 75V; Resistance: 120Ohm; Temperature Coefficient: 100ppm/degreesC; Number of Terminations: 2; Military Standard: Not; Tolerance: 1%; Min Operating Temperature: -55degC; Packaging: TapeandReel; Lead Free: LeadFree; Max Operating Temperature: 155degC; Manufacturer URL: http://www.panasonic.com/; Case Code (Imperial): 0603; REACH SVHC: NoSVHC; Width: 0.031inch; Datasheet URL: https://industrial.panasonic.com/cdbs/www-data/pdf/RDA0000/AOA0000C283.pdf; RoHSCompliant: true; Max Power Dissipation: 100mW; Termination: SMD/SMT; Package Reference: 0603; Height: 0.022inch; Depth: 0.8mm; Package Description: 2-Pin Surface Mount Device, Body 1.6 x 0.85 mm; Contact Plating: Tin; Length: 1.6mm; Package URL: http://www.st.com/st-web-ui/static/active/en/resource/technical/document/datasheet/CD00001320.pdf; Radiation Hardening: No; Package Quantity: 1; Number of Pins: 2; Datasheet Version: 42095.0; Voltage Rating: 75V; Composition: ThickFilm; Case/Package: 0603; Mount: SurfaceMount; Case Code (Metric): 1608
R24 R25 R29 = CMP-2000-03446-2: RES Thick Film, 51Ω, 1%, 0.1W, 100ppm/°C, 0603; Power Rating: 100mW; Voltage Rating: 75V; Resistance: 51R; Military Standard: Not; Case Code (Imperial): 0603; Max Operating Temperature: 155°C; Temperature Coefficient: 100ppm/°C; Lead Free: Lead Free; Weight: 7.1E-05oz; Number of Pins: 2; Package Quantity: 10; Case/Package: 0603; Termination: SMD/SMT; Min Operating Temperature: -55°C; Tolerance: 1%; Contact Plating: Tin; Height: 0.45mm; Working Voltage: 75V; Radiation Hardening: No; Packaging: Tape and Reel; Composition: Thick Film; Max Power Dissipation: 100mW; Width: 0.85mm; Depth: 0.85mm; Length: 1.55mm; Case Code (Metric): 1608; Voltage Rating (DC): 75V; Number of Terminations: 2; Features: Automotive AEC-Q200
R26 R28 R33 R39 R45 R47 = CMP-2000-00435-2: Chip Resistor, 330 Ohm, +/- 1%, 0.1 W, -55 to 155 degC, 0603 (1608 Metric), RoHS, Tape and Reel; Gender: Male; Mating Cycles: 10000; Current Rating: 500 mA; Voltage Rating: 10 V; REACH SVHC: No SVHC; PackageDescription: 2-Pin Surface Mount Device, Body 1.6 x 0.85 mm; Contact Finish: Gold; Pins: 8; ComponentLink1Description: Manufacturer URL; Packaging: Tape and Reel; Max Operating Temperature: 85 degC; Contact Material: Copper; Height: 1.45 mm; Width: 1.45 mm; DatasheetVersion: Apr-15; Package Quantity: 1500; Contact Plating: Gold; PackageReference: 0603; Mount: Surface Mount; Lead Pitch: 1.1 mm; Min Operating Temperature: -25 degC; ComponentLink1URL: http://www.panasonic.com/; ComponentLink2URL: http://industrial.panasonic.com/cdbs/www-data/pdf/RDA0000/AOA0000C86.pdf; Length: 13.7 mm; ComponentLink2Description: Datasheet; RoHSCompliant: true
SW1 = CMP-10040-000029-1: SWITCH TACTILE SPST-NO 0.02A 15V; Operating Force: 240gf; Switch Travel: 0.13mm; Illumination Type: Non-Illuminated; Throw Configuration: SPST; Number of Ports: 1; Current Rating: 5A; Mechanical Life: 500000Cycles; Switch Function: Off-Mom; Connector Type: USB; Actuator Type: Standard; Gender: Receptacle; Number of Contacts: 24; Contact Plating: Gold; Insulation Color: Black; Min Operating Temperature: -40°C; Packaging: Tape and Reel; Flammability Rating: UL94 V-0; Max Operating Temperature: 85°C; Termination: Solder; Mount: Surface Mount
TP4-TP16 = CMP-00028-00002-2: 0.6mm round; Pins: 1
U3 = CMP-020-00024-1: MCU 32-bit ARM Cortex M7 RISC 1MB Flash 1.8V/2.5V/3.3V 100-Pin LQFP Tray
U4 U5 = CMP-04872-000178-1: IC TRANSCEIVER 1/1 SOT23-8; Data Rate: 1Mbps; Packaging: Tape and Reel; Min Operating Temperature: -40°C; Max Operating Temperature: 125°C; RoHS Compliant: Yes; Lead Free: Lead Free; Case/Package: SOT-23-8; Mount: Surface Mount
U8 = CMP-014-00004-1: LM2902 Series 30 V 1.3 MHz Low-Power Quad Operational Amplifier - QFN-16 (3x3)
Y1 = CMP-27762-011708-1: Crystal 48MHz ±20ppm 18pF SMD-4 3.2mm x 2.5mm; Series Resistance: 35R; Frequency Stability: 50ppm; Package Quantity: 1000; Packaging: Tape and Reel; Mount: Surface Mount; Length: 3.2mm; Load Capacitance: 18pF; Max Operating Temperature: 70°C; Operating Frequency: 48 MHz; RoHS Compliant: Yes; Series: ABM8; Frequency Tolerance: 20ppm; Lead Free: Lead Free; Min Operating Temperature: -20°C; Case/Package: CSMD; Number of Pins: 4; Height: 0.031inch; ESR (Equivalent Series Resistance): 35R; Frequency: 48MHz; Radiation Hardening: No; Width: 0.098inch; Tolerance: 20ppm; Termination: SMD/SMT; Depth: 2.5mm; Resistor Type: Ceramic; REACH SVHC: No SVHC
Y2 = CMP-40224-000006-1: CRYSTAL 32.7680KHZ 12.5PF SMD; Manufacturer: ECS International; Frequency: 32.768kHz; Esr: 90kΩ; Tolerance: 20ppm; Device Class L1: Passive Components; Load Capacitance: 12.5pF; Temperature: -40°C to +85°C; ComponentLink2URL: https://ecsxtal.com/store/pdf/ECX-1210.pdf; Series: ECX-1210; Octopart: https://octopart.com/ecs-.327-12.5-1210-tr-ecs+international-81221340; ComponentLink2Description: Datasheet; Temperature Range Low: -40°C; Digikey Description: CRYSTAL 32.7680KHZ 12.5PF SMD; Lead Free: Yes; RoHS: TRUE; Device Class L3: Crystals; Automotive: No; Category: Crys; Height: 0.5mm; Manufacturer Part Number: ECS-.327-12.5-1210-TR; Temperature Range High: +85°C; Device Class L2: Crystals / Oscillators; Package: ECX-1210

## Sheet SD.SchDoc
size A4; SheetNumber: 3; SheetTotal: 5
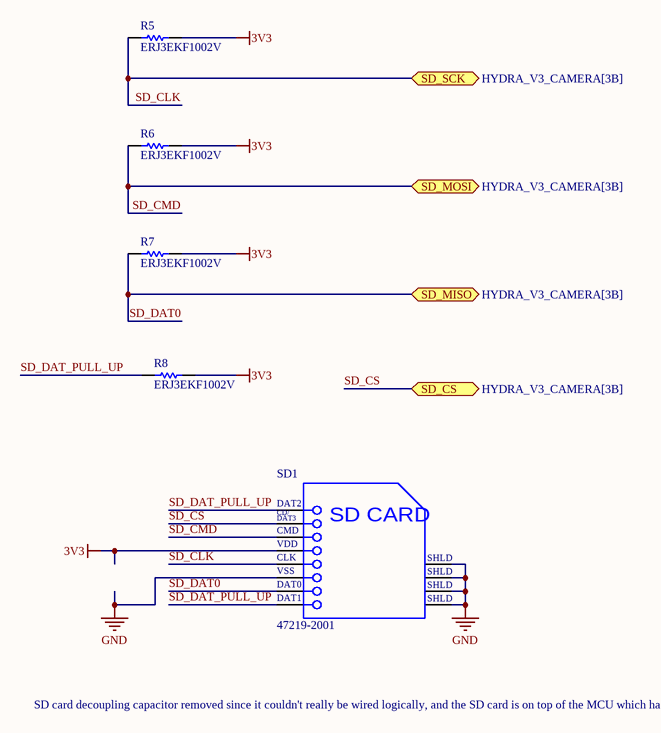
[diagram p4: SD.SchDoc]

### Parts
R5  ERJ3EKF1002V  [RESC1609X55X30LL15T15]
R6  ERJ3EKF1002V  [RESC1609X55X30LL15T15]
R7  ERJ3EKF1002V  [RESC1609X55X30LL15T15]
R8  ERJ3EKF1002V  [RESC1609X55X30LL15T15]
SD1  47219-2001  [MOLX-47219-2001-8_V]

### Ports
SD_CS (bidir, see HYDRA_V3_CAMERA[3B]), SD_MISO (bidir, see HYDRA_V3_CAMERA[3B]), SD_MOSI (bidir, see HYDRA_V3_CAMERA[3B]), SD_SCK (bidir, see HYDRA_V3_CAMERA[3B])

### Nets
3V3: R5.2 R6.2 R7.2 R8.2 SD1.4(VDD)  [project net DVDDIO]
GND: SD1.6(VSS) SD1.9(SHLD) SD1.10(SHLD) SD1.11(SHLD) SD1.12(SHLD)
SD_CLK: R5.1 SD1.5(CLK) ; port SD_SCK
SD_CMD: R6.1 SD1.3(CMD) ; port SD_MOSI
SD_CS: SD1.2(CD/DAT3) ; port SD_CS
SD_DAT0: R7.1 SD1.7(DAT0) ; port SD_MISO
SD_DAT_PULL_UP: R8.1 SD1.1(DAT2) SD1.8(DAT1)

### Notes on the sheet
- SD card decoupling capacitor removed since it couldn't really be wired logically, and the SD card is on top of the MCU which has a wealth of decoupling capacitors linked to the power plane near the SD card's supply plane which is also linked to the power plane
- (in symbol CMP-2000-05245-1) CD/; DAT3; SD CARD

### Library data of the parts
R5-R8 = CMP-1012-00623-3: as R2 on sheet OC_PROT; Number of Pins: 2; Package Reference: 603; Depth: 0.8mm; Mount: SurfaceMount; Package Description: 2-Pin Surface Mount Device, Body 1.6 x 0.85 mm; Datasheet Version: 02/2017; Length: 1.6mm; Lead Free: LeadFree; Height: 0.45mm; Number of Terminations: 2; Max Power Dissipation: 100mW; Min Operating Temperature: -55degC; Datasheet URL: https://industrial.panasonic.com/cdbs/www-data/pdf/RDA0000/AOA0000C304.pdf; Termination: SMD/SMT; Case Code (Metric): 1608; Case Code (Imperial): 0603; Tolerance: 1%; Max Operating Temperature: 155degC; RoHSCompliant: true; Voltage Rating (DC): 75V; Radiation Hardening: No; Packaging: TapeandReel; Composition: ThickFilm; Mounting Technology: SurfaceMount; Manufacturer URL: http://www.panasonic.com/; Width: 0.031inch; REACH SVHC: NoSVHC; Contact Plating: Tin; Military Standard: Not; Package Quantity: 1
SD1 = CMP-2000-05245-1: MicroSD Card Connector, Hinge Type, -40 to 85 degC, 8-Pin SMD, RoHS, Tape and Reel; Manufacturer: Molex; Current Rating: 500mA; Number of Contacts: 8; Pitch: 1.09mm; Insertion - Extraction Style: Hinged; Voltage Rating: 100VDC; Product: CardConnectors; Contact Material: CopperAlloy; Series: 47219; Packaging: Reel; Brand: Molex; Product Category: MemoryCardConnectors; Housing Material: Thermoplastic; Mounting Style: SMD/SMT; Termination Style: SMD; Datasheet Version: Rev. F, 06/2009; Card Type: microSD; Manufacturer URL: http://www.molex.com/; RoHS: Details; Datasheet URL: http://www.molex.com/pdm_docs/sd/472192001_sd.pdf; Factory Pack Quantity: 2400

## Sheet CAMERA_INTERFACE.SchDoc
size B; SheetNumber: 5; SheetTotal: 5
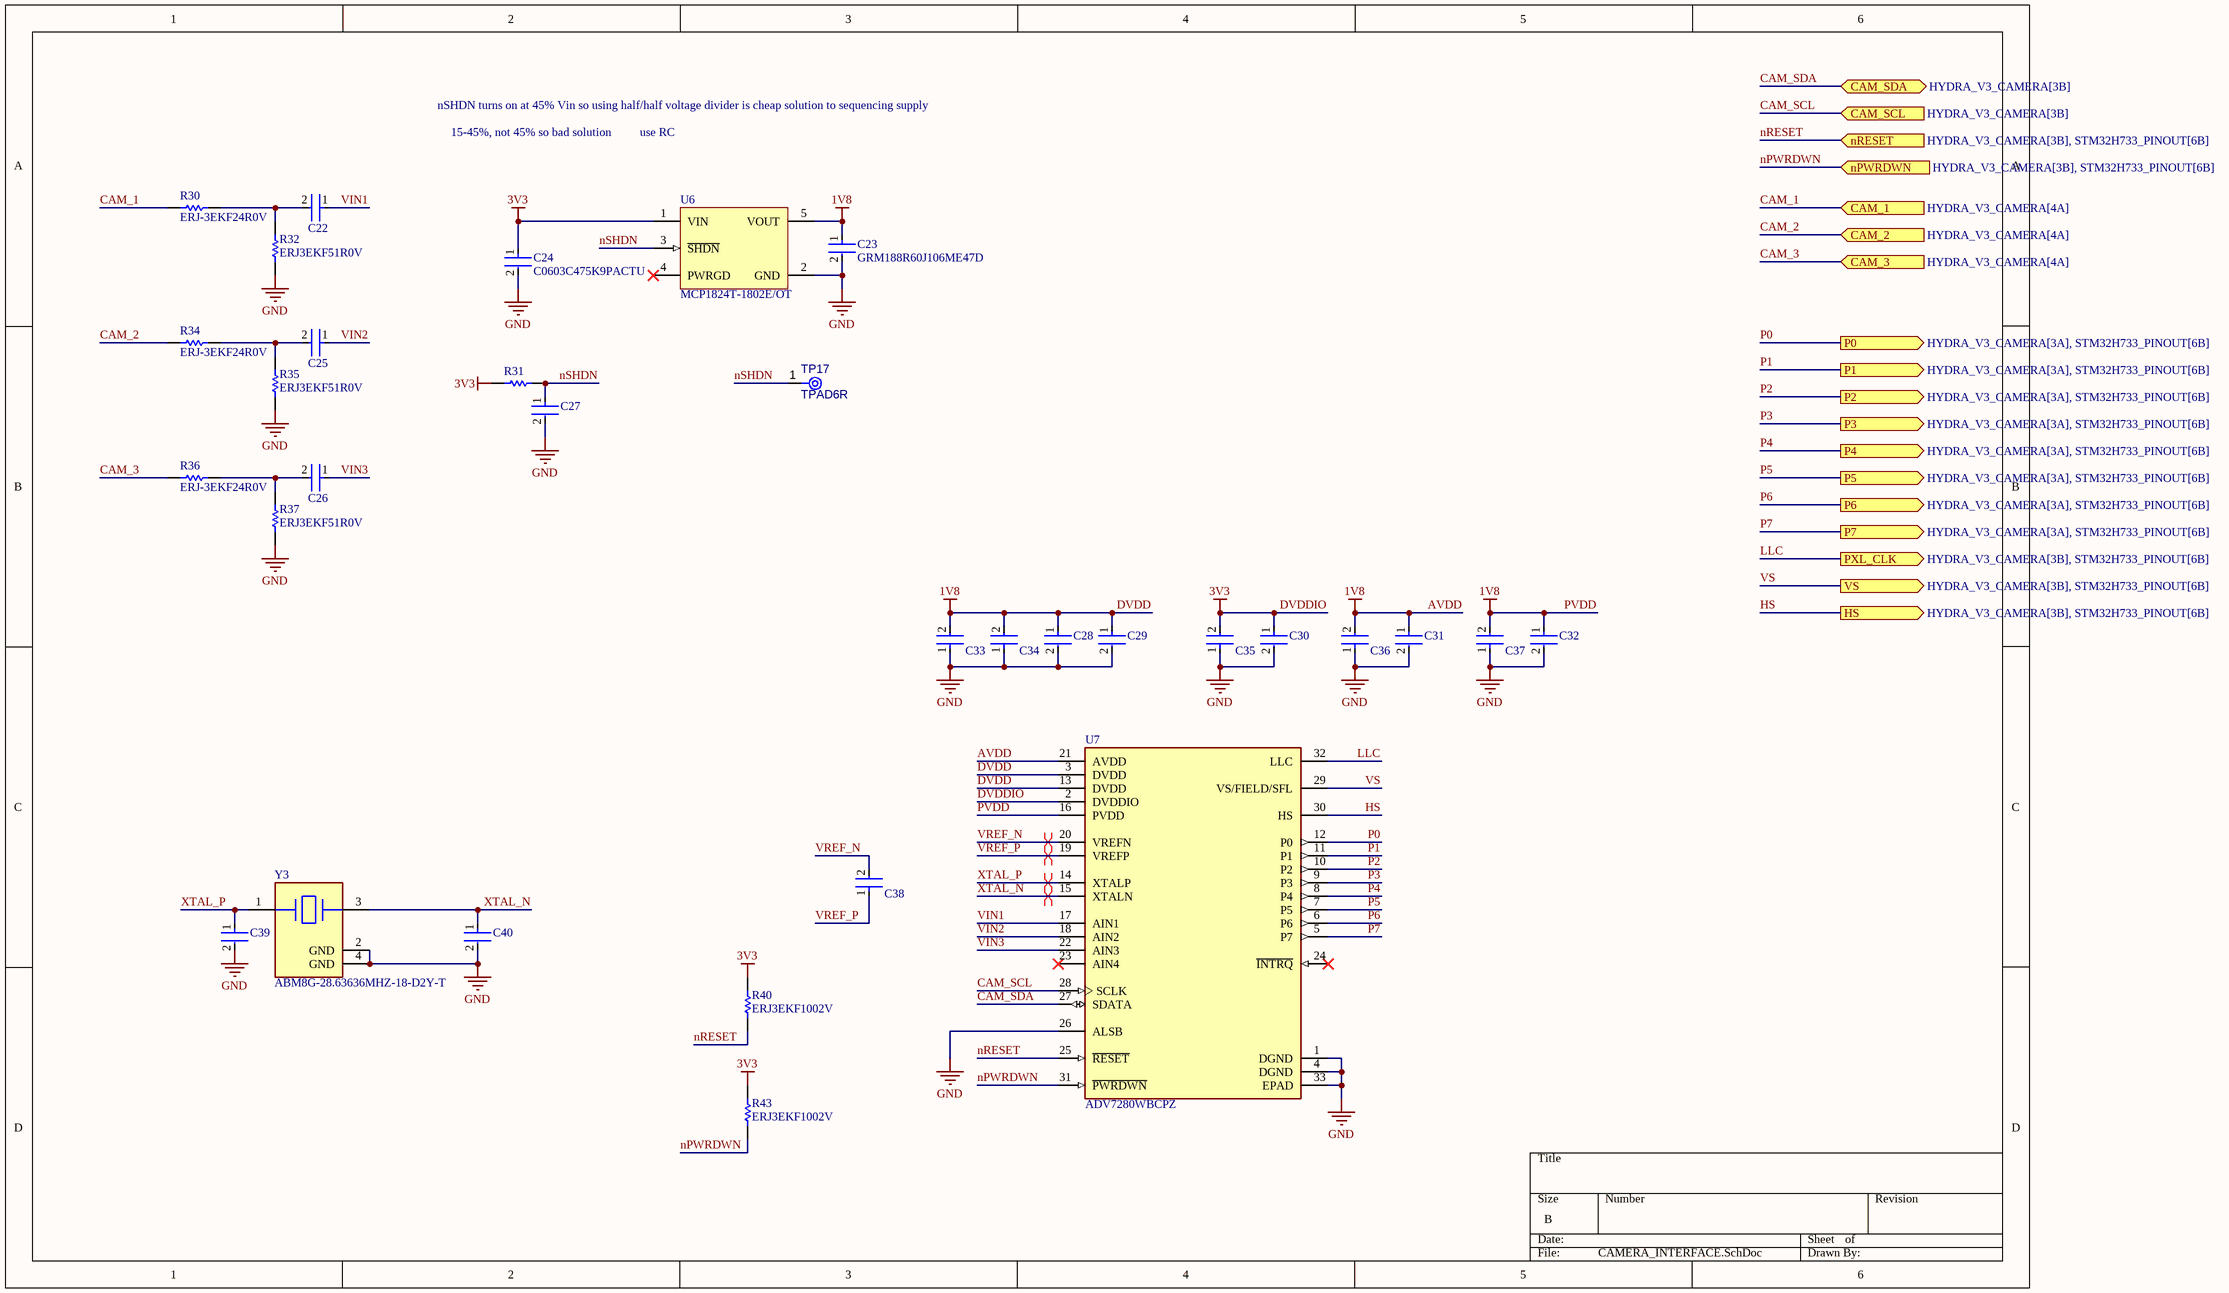
[diagram p5: CAMERA_INTERFACE.SchDoc]

### Parts
C22  C0402C104K8PACTU  [FP-C0402-BB-MFG]  (value not drawn)
C23  GRM188R60J106ME47D  [FP-GRM188-0_1-e0_2_0_55-IPC_A]
C24  C0603C475K9PACTU  [FP-C0603-CG-MFG]
C25  C0402C104K8PACTU  [FP-C0402-BB-MFG]  (value not drawn)
C26  C0402C104K8PACTU  [FP-C0402-BB-MFG]  (value not drawn)
C27  C0603C475K9PACTU  [FP-C0603-CG-MFG]  (value not drawn)
C28  CC0603KRX7R9BB103  [FP-CC0603-DA-MFG]  (value not drawn)
C29  CC0603KRX7R9BB103  [FP-CC0603-DA-MFG]  (value not drawn)
C30  CC0603KRX7R9BB103  [FP-CC0603-DA-MFG]  (value not drawn)
C31  CC0603KRX7R9BB103  [FP-CC0603-DA-MFG]  (value not drawn)
C32  CC0603KRX7R9BB103  [FP-CC0603-DA-MFG]  (value not drawn)
C33  C0402C104K8PACTU  [FP-C0402-BB-MFG]  (value not drawn)
C34  C0402C104K8PACTU  [FP-C0402-BB-MFG]  (value not drawn)
C35  C0402C104K8PACTU  [FP-C0402-BB-MFG]  (value not drawn)
C36  C0402C104K8PACTU  [FP-C0402-BB-MFG]  (value not drawn)
C37  C0402C104K8PACTU  [FP-C0402-BB-MFG]  (value not drawn)
C38  C0402C104K8PACTU  [FP-C0402-BB-MFG]  (value not drawn)
C39  C0603C470J1GACTU  [FP-C0603C-CF-MFG]  (value not drawn)
C40  C0603C470J1GACTU  [FP-C0603C-CF-MFG]  (value not drawn)
R30  ERJ-3EKF24R0V  [RESC1608X55X30ML15T15]
R31  ERJ3EKF1002V  [RESC1609X55X30LL15T15]  (value not drawn)
R32  ERJ3EKF51R0V  [RESC1608X55X30NL15T15]
R34  ERJ-3EKF24R0V  [RESC1608X55X30ML15T15]
R35  ERJ3EKF51R0V  [RESC1608X55X30NL15T15]
R36  ERJ-3EKF24R0V  [RESC1608X55X30ML15T15]
R37  ERJ3EKF51R0V  [RESC1608X55X30NL15T15]
R40  ERJ3EKF1002V  [RESC1609X55X30LL15T15]
R43  ERJ3EKF1002V  [RESC1609X55X30LL15T15]
TP17  TPAD6R  [TP06R]  (no BOM)
U6  MCP1824T-1802E/OT  [SOT-23-OT5_M]
U7  ADV7280WBCPZ  [FP-CP-32-12-MFG]
Y3  ABM8G-28.63636MHZ-18-D2Y-T  [FP-ABM8G-MFG]

### Ports
CAM_1 (in, see HYDRA_V3_CAMERA[4A]), CAM_2 (in, see HYDRA_V3_CAMERA[4A]), CAM_3 (in, see HYDRA_V3_CAMERA[4A]), CAM_SCL (in, see HYDRA_V3_CAMERA[3B]), CAM_SDA (bidir, see HYDRA_V3_CAMERA[3B]), HS (out, see HYDRA_V3_CAMERA[3B], STM32H733_PINOUT[6B]), nPWRDWN (in, see HYDRA_V3_CAMERA[3B], STM32H733_PINOUT[6B]), nRESET (in, see HYDRA_V3_CAMERA[3B], STM32H733_PINOUT[6B]), P0 (out, see HYDRA_V3_CAMERA[3A], STM32H733_PINOUT[6B]), P1 (out, see HYDRA_V3_CAMERA[3A], STM32H733_PINOUT[6B]), P2 (out, see HYDRA_V3_CAMERA[3A], STM32H733_PINOUT[6B]), P3 (out, see HYDRA_V3_CAMERA[3A], STM32H733_PINOUT[6B]), P4 (out, see HYDRA_V3_CAMERA[3A], STM32H733_PINOUT[6B]), P5 (out, see HYDRA_V3_CAMERA[3A], STM32H733_PINOUT[6B]), P6 (out, see HYDRA_V3_CAMERA[3A], STM32H733_PINOUT[6B]), P7 (out, see HYDRA_V3_CAMERA[3A], STM32H733_PINOUT[6B]), PXL_CLK (out, see HYDRA_V3_CAMERA[3B], STM32H733_PINOUT[6B]), VS (out, see HYDRA_V3_CAMERA[3B], STM32H733_PINOUT[6B])

### Nets
AVDD: C23.1 C28.1 C29.1 C31.1 C32.1 C33.2 C34.2 C36.2 C37.2 U6.5(VOUT) U7.3(DVDD) U7.13(DVDD) U7.16(PVDD) U7.21(AVDD)  [also labelled 1V8, DVDD, PVDD]
DVDDIO: C24.1 C30.1 C35.2 R31.1 R40.2 R43.2 U6.1(VIN) U7.2(DVDDIO)  [also labelled 3V3]
GND: C23.2 C24.2 C27.2 C28.2 C29.2 C30.2 C31.2 C32.2 C33.1 C34.1 C35.1 C36.1 C37.1 C39.2 C40.2 R32.1 R35.1 R37.1 U6.2(GND) U7.1(DGND) U7.4(DGND) U7.26(ALSB) U7.33(EPAD) Y3.2(GND) Y3.4(GND)
CAM_1: R30.1 ; port CAM_1
CAM_2: R34.1 ; port CAM_2
CAM_3: R36.1 ; port CAM_3
CAM_SCL: U7.28(SCLK) ; port CAM_SCL
CAM_SDA: U7.27(SDATA) ; port CAM_SDA
HS: U7.30(HS) ; port HS
LLC: U7.32(LLC) ; port PXL_CLK
nPWRDWN: R43.1 U7.31(~{PWRDWN}) ; port nPWRDWN
nRESET: R40.1 U7.25(~{RESET}) ; port nRESET
nSHDN: C27.1 R31.2 TP17.1(TP) U6.3(~{SHDN})
P0: U7.12(P0) ; port P0
P1: U7.11(P1) ; port P1
P2: U7.10(P2) ; port P2
P3: U7.9(P3) ; port P3
P4: U7.8(P4) ; port P4
P5: U7.7(P5) ; port P5
P6: U7.6(P6) ; port P6
P7: U7.5(P7) ; port P7
VIN1: C22.1 U7.17(AIN1)
VIN2: C25.1 U7.18(AIN2)
VIN3: C26.1 U7.22(AIN3)
VREF_N: C38.2 U7.20(VREFN)
VREF_P: C38.1 U7.19(VREFP)
VS: U7.29(VS/FIELD/SFL) ; port VS
XTAL_N: C40.1 U7.15(XTALN) Y3.3
XTAL_P: C39.1 U7.14(XTALP) Y3.1
NetC22_2: C22.2 R30.2 R32.2
NetC25_2: C25.2 R34.2 R35.2
NetC26_2: C26.2 R36.2 R37.2

Not connected (* = marked no-connect by the designer): U6 4(PWRGD)*; U7 23(AIN4)* 24(~{INTRQ})*

### Layout directives
differential pair: VREF_N, VREF_P, XTAL_N, XTAL_P

### Notes on the sheet
- nSHDN turns on at 45% Vin so using half/half voltage divider is cheap solution to sequencing supply
- 15-45%, not 45% so bad solution
- use RC

### Library data of the parts
C22 C25 C26 C33-C38 = CMP-2008-02046-2: as C1 on sheet OC_PROT; Package: C0402-BB; Temperature: -55°C to +125°C; ComponentLink2Description: Datasheet; Temperature Characteristic: X5R; Device Class L1: Passive Components; Height: 0.55mm; Lead Free: Yes; ComponentLink2URL: https://content.kemet.com/datasheets/KEM_C1002_X7R_SMD.pdf; Device Class L2: Capacitors; Temperature Range Low: -55°C; Temperature Range High: +125°C; RoHS: TRUE; Octopart: https://octopart.com/c0402c104k8pactu-kemet-140039; Automotive: No; Mouser Description: Capacitor 100 nF 10 VDC 0402; Category: Cap; Voltage Rating: 10 V; Digikey Description: CAP CER 0.1UF 10V X5R 0402; Ipc Land Pattern Name: CAPC10050X50; Device Class L3: Ceramic Capacitors; Manufacturer Part Number: C0402C104K8PACTU
C23 = CMP-2006-02792-2: Chip Multilayer Ceramic Capacitors for General Purpose, 0603, 10uF, X5R, 15%, 20%, 6.3V; Packaging: Tape and Reel; Voltage Rating (DC): 6.3V; Width: 0.031inch; Termination: SMD/SMT; Dielectric: X5R; Package Quantity: 4000; Voltage Rating: 6.3V; Capacitance: 10uF; Case/Package: 0603; Min Operating Temperature: -55°C; Voltage: 6.3V; Length: 1.6mm; Thickness: 0.035inch; Lead Free: Lead Free; Depth: 0.8mm; Case Code (Imperial): 0603; Max Operating Temperature: 85°C; Material: Ceramic; Height: 0.8mm; Tolerance: 20%; Mount: Surface Mount; REACH SVHC: No SVHC; Radiation Hardening: No; Case Code (Metric): 1608
C24 C27 = CMP-2006-02256-2: CAP CER 4.7UF 6.3V X5R 0603; Manufacturer: Kemet; Temperature Coefficient: 15%; Tolerance: 10%; Material: Ceramic; Device Class L3: Ceramic Capacitors; RoHS: TRUE; Value: 4.7uF; Lead Free: Yes; ComponentLink2Description: Datasheet; Mouser Description: Multilayer Ceramic Capacitors MLCC - SMD/SMT 6.3volts 4.7uF X5R 10%; Package: C0603-CG; Digikey Description: CAP CER 4.7UF 6.3V X5R 0603; ComponentLink2URL: https://content.kemet.com/datasheets/KEM_C1006_X5R_SMD.pdf; Category: Cap; Temperature Range Low: -55°C; Capacitance: 4.7uF; Temperature: -55°C to +85°C; Octopart: https://octopart.com/c0603c475k9pactu-kemet-104242; Ipc Land Pattern Name: CAPC16080X80; Voltage Rating: 6.3V; Temperature Range High: +85°C; Height: 0.9mm; Temperature Characteristic: X5R; Device Class L1: Passive Components; Manufacturer Part Number: C0603C475K9PACTU; Automotive: No; Device Class L2: Capacitors
C28-C32 = CMP-2100-03600-2: CAP CER 10000PF 50V X7R 0603; Manufacturer: YAGEO; Tolerance: 0.1; Material: Ceramic; Temperature Coefficient: 15%; Value: 10 nF; Mouser Description: Multilayer Ceramic Capacitor, CC Series, 0.01 - F, - 10%, X7R, 50 V, 0603 [1608 Metric]; Digikey Description: CAP CER 10000PF 50V X7R 0603; Height: 0.9mm; Category: Cap; Temperature Characteristic: X7R; Footprint Url: http://www.yageo.com/exep/pages/download/literatures/UPY-C_GEN_24.pdf; Lead Free: Yes; Voltage Rating: 50 V; Manufacturer Part Number: CC0603KRX7R9BB103; Temperature: -55°C to +125°C; Device Class L3: Ceramic Capacitors; ComponentLink2Description: Datasheet; Voltage: 50 V; Package: CC0603-DA; Octopart: https://octopart.com/cc0603krx7r9bb103-yageo-192938; Automotive: No; Temperature Range High: +125°C; Temperature Range Low: -55°C; RoHS: TRUE; Device Class L1: Passive Components; ComponentLink2URL: http://www.yageo.com/documents/recent/UPY-GPHC_X7R_6.3V-to-50V_18.pdf; Device Class L2: Capacitors; Capacitance: 10 nF
C39 C40 = CMP-2006-03321-2: CAP CER 47PF 100V 5% NP0 0603; Manufacturer: KEMET; Temperature Characteristic: C0G; Temperature Coefficient: 30ppm/°C; Automotive Grade: Grade 1; Material: Ceramic; Tolerance: 0.05; Digikey Description: CAP CER 47PF 100V 5% NP0 0603; Value: 47 pF; Category: Cap; Device Class L2: Capacitors; Device Class L1: Passive Components; Package: C0603C-CF; Octopart: https://octopart.com/c0603c470j1gactu-kemet-3768219; Lead Free: Yes; Temperature Range High: +125°C; Device Class L3: Ceramic Capacitors; Height: 0.87mm; Temperature: -55°C to +125°C; Mouser Description: Multilayer Ceramic Capacitors MLCC - SMD/SMT 100volts 47pF C0G 5%; Automotive: Yes; Capacitance: 47 pF; RoHS: TRUE; ComponentLink2URL: https://api.kemet.com/component-edge/download/datasheet/C0603C100J5GACAUTO.pdf; Voltage Rating: 100 V; Manufacturer Part Number: C0603C470J1GACTU; ComponentLink2Description: Datasheet; Temperature Range Low: -55°C
R30 R34 R36 = CMP-1012-00325-2: Manufacturer: Panasonic; Part Number: ERJ-3EKF24R0V
R31 R40 R43 = CMP-1012-00623-3: as R2 on sheet OC_PROT; Number of Pins: 2; Package Reference: 603; Depth: 0.8mm; Mount: SurfaceMount; Package Description: 2-Pin Surface Mount Device, Body 1.6 x 0.85 mm; Datasheet Version: 02/2017; Length: 1.6mm; Lead Free: LeadFree; Height: 0.45mm; Number of Terminations: 2; Max Power Dissipation: 100mW; Min Operating Temperature: -55degC; Datasheet URL: https://industrial.panasonic.com/cdbs/www-data/pdf/RDA0000/AOA0000C304.pdf; Termination: SMD/SMT; Case Code (Metric): 1608; Case Code (Imperial): 0603; Tolerance: 1%; Max Operating Temperature: 155degC; RoHSCompliant: true; Voltage Rating (DC): 75V; Radiation Hardening: No; Packaging: TapeandReel; Composition: ThickFilm; Mounting Technology: SurfaceMount; Manufacturer URL: http://www.panasonic.com/; Width: 0.031inch; REACH SVHC: NoSVHC; Contact Plating: Tin; Military Standard: Not; Package Quantity: 1
R32 R35 R37 = CMP-2000-00547-1: Manufacturer: Panasonic; Part Number: ERJ3EKF51R0V
TP17 = CMP-00028-00002-2: 0.6mm round; Pins: 1
U6 = CMP-0136-00652-1: 300 mA, Low Voltage, Low Quiescent Current LDO Regulator, 5-Pin SOT-23, Extended Temperature, Tape and Reel; DatasheetVersion: revA, Aug-2007; PackageDescription: 5-Lead Plastic Small Outline Transistor (OT) [SOT-23]; Code_IPC: SOT23-5; PackageReference: SOT-23-OT5; PackageVersion: revBB, Aug-2009
U7 = CMP-09080-000010-1: IC VIDEO DECODER SDTV 32-LFCSP; Min Supply Voltage: 1.71V; Max Supply Voltage: 1.89V; Resolution: 10b; Interface: I2C; Number of Bits: 10; Number of Inputs: 4; Operating Supply Current: 70mA; Number of A/D Converters: 1; REACH SVHC: No SVHC; Case/Package: LFCSP EP; Max Operating Temperature: 105°C; Number of Pins: 32; Length: 5.1mm; RoHS Compliant: Yes; Width: 5.1mm; Mount: Surface Mount; Package Quantity: 490; Contact Plating: Tin; Min Operating Temperature: -40°C; Height: 0.75mm; Series: AUTOMOTIVE; Lead Free: Contains Lead; Packaging: Tray
Y3 = CMP-27762-014063-1: Crystal 28.63636MHz ±20ppm (Tol) ±30ppm (Stability) 18pF FUND 50Ω 4-Pin SMD T/R; ESR (Equivalent Series Resistance): 50R; Operating Frequency: 28.6 MHz; Length: 3.2mm; Lead Free: Lead Free; Width: 2.5mm; Termination: SMD/SMT; Series: ABM8G; Max Operating Temperature: 85°C; REACH SVHC: Yes; Mount: Surface Mount; Case/Package: SMD/SMT; Frequency Tolerance: 20ppm; Number of Pins: 4; Load Capacitance: 18pF; Tolerance: 20ppm; Series Resistance: 50R; Height: 1mm; Frequency: 28.63636MHz; Min Operating Temperature: -40°C; Frequency Stability: 30ppm; Package Quantity: 1000; Packaging: Tape and Reel; Radiation Hardening: No

## Nets that join several sheets
AVDD: STM32H733_PINOUT (R17.2), CAMERA_INTERFACE (14 pins)
CAM_5V: HYDRA_V3_CAMERA (F1.2 F2.2 F3.2), OC_PROT (Q2.5-6-7-8)
DVDDIO: OC_PROT (Q4.5-6-7-8), STM32H733_PINOUT (31 pins), SD (5 pins), CAMERA_INTERFACE (8 pins)
GND: HYDRA_V3_CAMERA (45 pins), OC_PROT (7 pins), STM32H733_PINOUT (47 pins), SD (5 pins), CAMERA_INTERFACE (25 pins)
VCC: HYDRA_V3_CAMERA (J5.01 J5.02 J7.01 J7.02), OC_PROT (U1.6 U2.6), STM32H733_PINOUT (R15.2 TP5.1)
3V3_PRE_SHUNT: HYDRA_V3_CAMERA (8 pins), OC_PROT (R10.1 R11.2)
5V_PRE_SHUNT: HYDRA_V3_CAMERA (8 pins), OC_PROT (R1.1 R2.2)
CAM_1: HYDRA_V3_CAMERA (J1.1), CAMERA_INTERFACE (R30.1)
CAM_2: HYDRA_V3_CAMERA (J2.1), CAMERA_INTERFACE (R34.1)
CAM_3: HYDRA_V3_CAMERA (J3.1), CAMERA_INTERFACE (R36.1)
CAM_SCL: STM32H733_PINOUT (U3.59), CAMERA_INTERFACE (U7.28)
CAM_SDA: STM32H733_PINOUT (R44.2 U3.60), CAMERA_INTERFACE (U7.27)
CAN0_N: HYDRA_V3_CAMERA (J5.16 J7.16), STM32H733_PINOUT (R22.1 TP15.1 U4.6)
CAN0_P: HYDRA_V3_CAMERA (J5.15 J7.15), STM32H733_PINOUT (R22.2 TP12.1 U4.7)
CAN1_N: HYDRA_V3_CAMERA (J5.20 J7.20), STM32H733_PINOUT (R23.1 TP16.1 U5.6)
CAN1_P: HYDRA_V3_CAMERA (J5.19 J7.19), STM32H733_PINOUT (R23.2 TP13.1 U5.7)
HS: STM32H733_PINOUT (U3.28), CAMERA_INTERFACE (U7.30)
LLC: STM32H733_PINOUT (R38.1 U3.30), CAMERA_INTERFACE (U7.32)
nPWRDWN: STM32H733_PINOUT (U3.87), CAMERA_INTERFACE (R43.1 U7.31)
nRESET: STM32H733_PINOUT (U3.86), CAMERA_INTERFACE (R40.1 U7.25)
P0: STM32H733_PINOUT (U3.63), CAMERA_INTERFACE (U7.12)
P1: STM32H733_PINOUT (U3.64), CAMERA_INTERFACE (U7.11)
P2: STM32H733_PINOUT (U3.65), CAMERA_INTERFACE (U7.10)
P3: STM32H733_PINOUT (U3.66), CAMERA_INTERFACE (U7.9)
P4: STM32H733_PINOUT (U3.79), CAMERA_INTERFACE (U7.8)
P5: STM32H733_PINOUT (U3.84), CAMERA_INTERFACE (U7.7)
P6: STM32H733_PINOUT (U3.95), CAMERA_INTERFACE (U7.6)
P7: STM32H733_PINOUT (U3.96), CAMERA_INTERFACE (U7.5)
PYRO_PWR: HYDRA_V3_CAMERA (16 pins), STM32H733_PINOUT (R16.2 TP6.1)
SD_CMD: STM32H733_PINOUT (R48.2), SD (R6.1 SD1.3)
SD_DAT0: STM32H733_PINOUT (R46.1), SD (R7.1 SD1.7)
VS: STM32H733_PINOUT (U3.93), CAMERA_INTERFACE (U7.29)